# EAGLE design PRO_controller (EAGLE 8.5.0)

## Sheet 1 of 4
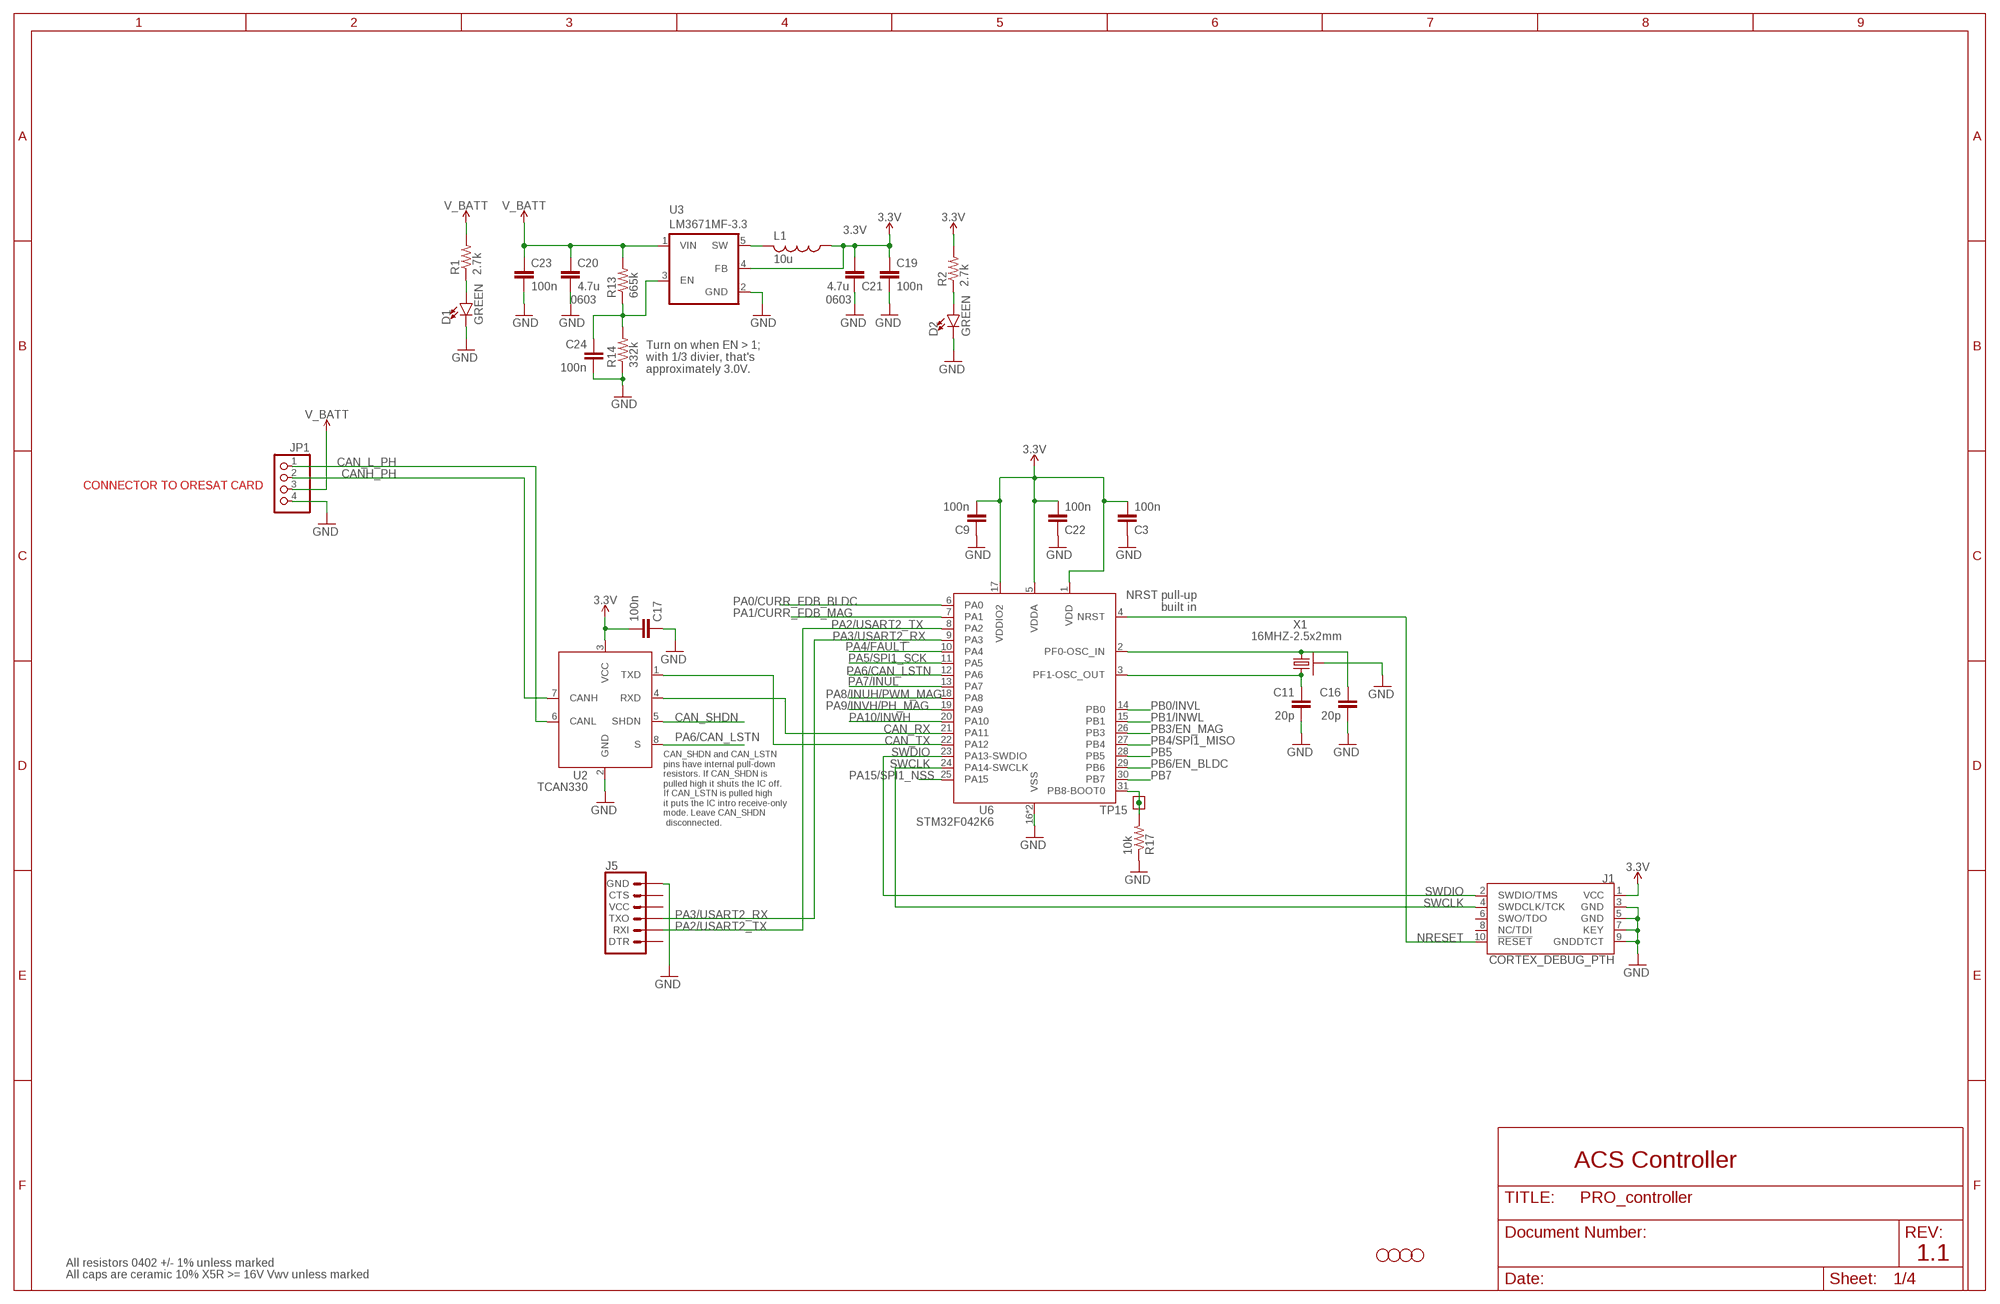
[diagram p0: schematic, sheet 1]

### Parts
C3  100n  C-EU0402-B-NOSILK  [.0402-B-NOSILK]
C9  100n  C-EU0402-B-NOSILK  [.0402-B-NOSILK]
C11  20p  C-EU0402-B-NOSILK  [.0402-B-NOSILK]
C16  20p  C-EU0402-B-NOSILK  [.0402-B-NOSILK]
C17  100n  C-EU0402-B-NOSILK  [.0402-B-NOSILK]
C19  100n  C-EU0402-B-NOSILK  [.0402-B-NOSILK]
C20  4.7u  C-EUC0603  [C0603]
C21  4.7u  C-EUC0603  [C0603]
C22  100n  C-EU0402-B-NOSILK  [.0402-B-NOSILK]
C23  100n  C-EU0402-B-NOSILK  [.0402-B-NOSILK]
C24  100n  C-EU0402-B-NOSILK  [.0402-B-NOSILK]
D1  GREEN  LED-GREEN0603  [LED-0603]
D2  GREEN  LED-GREEN0603  [LED-0603]
H1  STAND-OFFTIGHT  [STAND-OFF-TIGHT]
H2  STAND-OFFTIGHT  [STAND-OFF-TIGHT]
H3  STAND-OFFTIGHT  [STAND-OFF-TIGHT]
H4  STAND-OFFTIGHT  [STAND-OFF-TIGHT]
J1  CORTEX_DEBUG_PTH  [2X5-PTH-1.27MM]
J5  6_PIN_SERIAL_TARGETSILK  [6_PIN_SERIAL_TARGET_SIDE_W_SILK]
JP1  PINHD-1X4  [1X04]
L1  10u  L-USL2012C  [L2012C]
R1  2.7k  R-US_0402-B-NOSILK  [.0402-B-NOSILK]
R2  2.7k  R-US_0402-B-NOSILK  [.0402-B-NOSILK]
R13  665k  R-US_0402-B-NOSILK  [.0402-B-NOSILK]
R14  332k  R-US_0402-B-NOSILK  [.0402-B-NOSILK]
R17  10k  R-US_0402-B-NOSILK  [.0402-B-NOSILK]
TP15  TEST-POINT  [2MM-TEST-POINT]
U2  TCAN330  [SOT23-8_TI-DCN]
U3  LM3671MF-3.3  LM3761  [SOT23-5]
U6  STM32F042K6  [QFP32-7X7]
X1  16MHZ-2.5x2mm  CRYSTAL-WITH-GND  [CRYSTAL_2.5X2]

### Nets
3.3V: C3.2 C9.2 C17.2 C19.1 C21.1 C22.2 J1.1(VCC) L1.1 R2.2 U2.3(VCC) U3.4(FB) U6.1(VDD) U6.5(VDDA) U6.17(VDDIO2) ; also sheet 2,3,4
BOOT: R17.2 TP15.1 U6.31(PB8-BOOT0)
CAN_L_PH: JP1.1 U2.6(CANL)
CAN_RX: U2.4(RXD) U6.21(PA11)
CAN_SHDN: U2.5(SHDN)
CAN_TX: U2.1(TXD) U6.22(PA12)
CANH_PH: JP1.2 U2.7(CANH)
CRYSTALIN: C16.1 U6.2(PF0-OSC_IN) X1.1
CRYSTALOUT: C11.1 U6.3(PF1-OSC_OUT) X1.3
GND: C3.1 C9.1 C11.2 C16.2 C17.1 C19.2 C20.2 C21.2 C22.1 C23.2 C24.2 D1.C D2.C J1.3(GND) J1.5(GND) J1.7(KEY) J1.9(GNDDTCT) J5.P$6(GND) JP1.4 R14.1 R17.1 U2.2(GND) U3.2(GND) U6.16(VSS) U6.32(VSS) X1.2(SHIELD) X1.4(SHIELD) ; also sheet 2,3,4
N$270: D1.A R1.1
N$271: D2.A R2.1
NRESET: J1.10(!RESET) U6.4(NRST)
PA0/CURR_FDB_BLDC: U6.6(PA0) ; also sheet 2
PA1/CURR_FDB_MAG: U6.7(PA1) ; also sheet 3
PA2/USART2_TX: J5.P$3(RXI) U6.8(PA2)
PA3/USART2_RX: J5.P$2(TXO) U6.9(PA3)
PA4/FAULT: U6.10(PA4) ; also sheet 2
PA5/SPI1_SCK: U6.11(PA5) ; also sheet 4
PA6/CAN_LSTN: U2.8(S) U6.12(PA6)
PA7/INUL: U6.13(PA7) ; also sheet 2
PA8/INUH/PWM_MAG: U6.18(PA8) ; also sheet 2,3
PA9/INVH/PH_MAG: U6.19(PA9) ; also sheet 2,3
PA10/INWH: U6.20(PA10) ; also sheet 2
PA15/SPI1_NSS: U6.25(PA15) ; also sheet 4
PB0/INVL: U6.14(PB0) ; also sheet 2
PB1/INWL: U6.15(PB1) ; also sheet 2
PB3/EN_MAG: U6.26(PB3) ; also sheet 3
PB4/SPI1_MISO: U6.27(PB4) ; also sheet 4
PB5: U6.28(PB5)
PB6/EN_BLDC: U6.29(PB6) ; also sheet 2
PB7: U6.30(PB7)
STEPD: L1.2 U3.5(SW)
SWCLK: J1.4(SWDCLK/TCK) U6.24(PA14-SWCLK)
SWDIO: J1.2(SWDIO/TMS) U6.23(PA13-SWDIO)
V_BATT: C20.1 C23.1 JP1.3 R1.2 R13.2 U3.1(VIN) ; also sheet 2,3
VDIV: C24.1 R13.1 R14.2 U3.3(EN)
Unconnected: J1.6(SWO/TDO) J1.8(NC/TDI) J5.P$1(DTR) J5.P$4(VCC) J5.P$5(CTS)

### Notes on the sheet
- 0603 | 0603
- Turn on when EN > 1; 
  with 1/3 divier, that's
  approximately 3.0V.
- CONNECTOR TO ORESAT CARD
- NRST pull-up
  built in
- CAN_SHDN and CAN_LSTN
  pins have internal pull-down
  resistors. If CAN_SHDN is 
  pulled high it shuts the IC off.
  If CAN_LSTN is pulled high
  it puts the IC intro receive-only
  mode. Leave CAN_SHDN
   disconnected.
- ACS Controller
- 1.1
- All resistors 0402 +/- 1% unless marked
- All caps are ceramic 10% X5R >= 16V Vwv unless marked

## Sheet 2 of 4
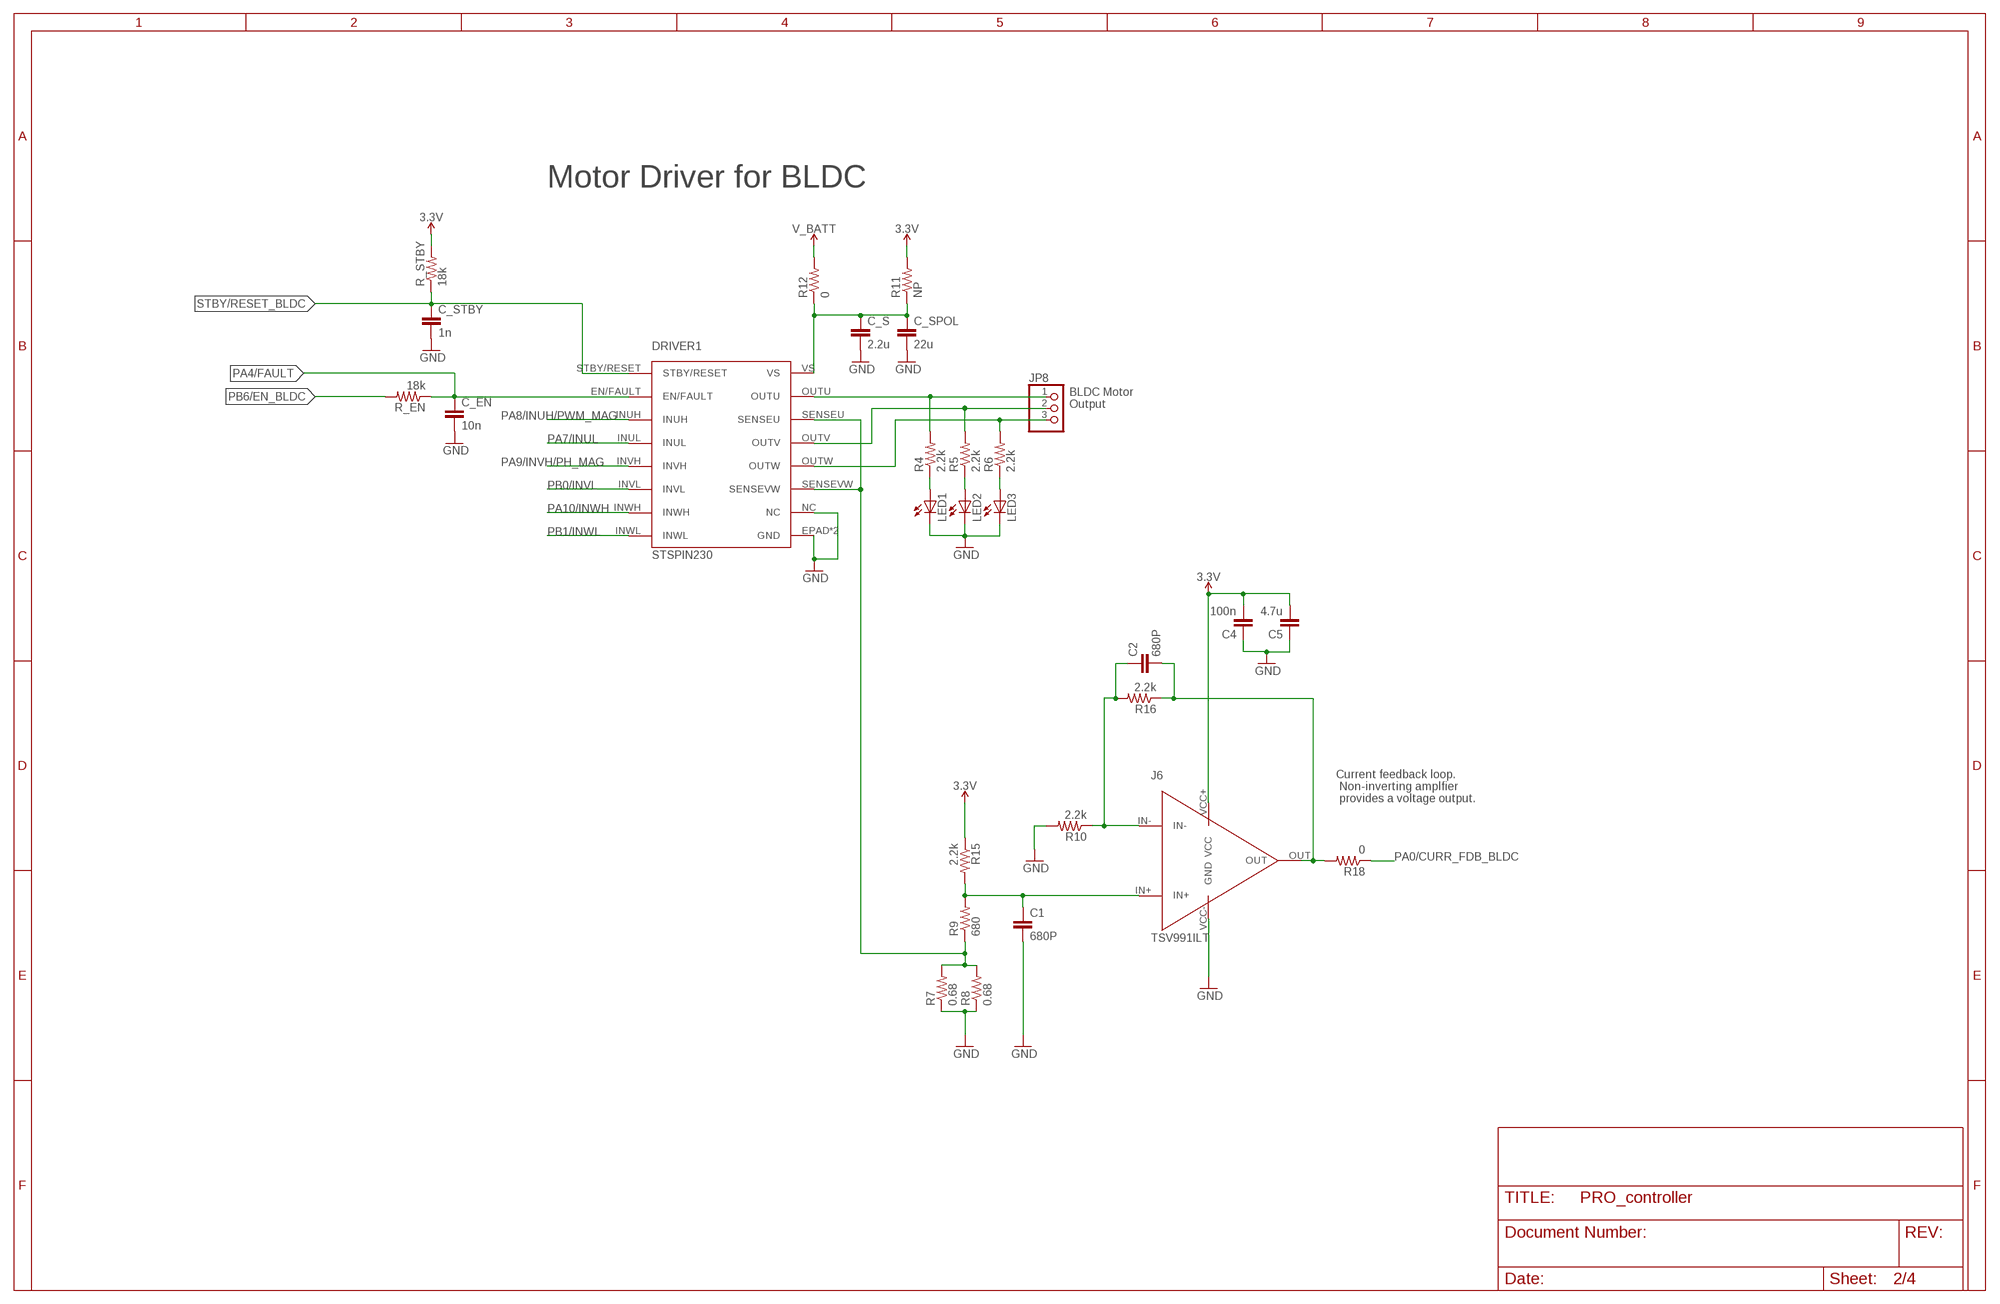
[diagram p1: schematic, sheet 2]

### Parts
C1  680P  C-EUC0402  [C0402]
C2  680P  C-EUC0402  [C0402]
C4  100n  C-EUC0402  [C0402]
C5  4.7u  C-EUC0402  [C0402]
C_EN  10n  C-EUC0402  [C0402]
C_S  2.2u  C-EUC0402  [C0402]
C_SPOL  22u  C-EUC0402  [C0402]
C_STBY  1n  C-EUC0402  [C0402]
DRIVER1  STSPIN230  [STSPIN230]
J6  TSV991ILT  [SOT23-5]
JP8  PINHD-1X3  [1X03]
LED1  LEDCHIP-LED0603  [CHIP-LED0603]
LED2  LEDCHIP-LED0603  [CHIP-LED0603]
LED3  LEDCHIP-LED0603  [CHIP-LED0603]
R4  2.2k  R-US_R0402  [R0402]
R5  2.2k  R-US_R0402  [R0402]
R6  2.2k  R-US_R0402  [R0402]
R7  0.68  R-US_R0402  [R0402]
R8  0.68  R-US_R0402  [R0402]
R9  680  R-US_R0402  [R0402]
R10  2.2k  R-US_R0402  [R0402]
R11  NP  R-US_R0402  [R0402]
R12  0  R-US_R0402  [R0402]
R15  2.2k  R-US_R0402  [R0402]
R16  2.2k  R-US_R0402  [R0402]
R18  0  R-US_R0402  [R0402]
R_EN  18k  R-US_R0402  [R0402]
R_STBY  18k  R-US_R0402  [R0402]

### Nets
3.3V: C4.2 C5.2 J6.VCC+(VCC) R11.2 R15.1 R_STBY.2 ; also sheet 1,3,4
GND: C1.2 C4.1 C5.1 C_EN.2 C_S.2 C_SPOL.2 C_STBY.2 DRIVER1.EPAD(GND) DRIVER1.GND DRIVER1.NC J6.VCC-(GND) LED1.C LED2.C LED3.C R7.1 R8.1 R10.2 ; also sheet 1,3,4
N$6: LED1.A R4.1
N$7: DRIVER1.OUTU JP8.1 R4.2
N$8: DRIVER1.OUTV JP8.2 R5.2
N$10: LED2.A R5.1
N$11: LED3.A R6.1
N$12: C_S.1 C_SPOL.1 DRIVER1.VS R11.1 R12.1
N$13: DRIVER1.SENSEU DRIVER1.SENSEVW R7.2 R8.2 R9.1
N$14: C2.1 J6.IN- R10.1 R16.2
N$16: C1.1 J6.IN+ R9.2 R15.2
N$21: DRIVER1.OUTW JP8.3 R6.2
N$29: C2.2 J6.OUT R16.1 R18.2
PA0/CURR_FDB_BLDC: R18.1 ; also sheet 1
PA4/FAULT: C_EN.1 DRIVER1.EN/FAULT R_EN.1 ; also sheet 1
PA7/INUL: DRIVER1.INUL ; also sheet 1
PA8/INUH/PWM_MAG: DRIVER1.INUH ; also sheet 1,3
PA9/INVH/PH_MAG: DRIVER1.INVH ; also sheet 1,3
PA10/INWH: DRIVER1.INWH ; also sheet 1
PB0/INVL: DRIVER1.INVL ; also sheet 1
PB1/INWL: DRIVER1.INWL ; also sheet 1
PB6/EN_BLDC: R_EN.2 ; also sheet 1
STBY/RESET_BLDC: C_STBY.1 DRIVER1.STBY/RESET R_STBY.1
V_BATT: R12.2 ; also sheet 1,3

### Notes on the sheet
- Motor Driver for BLDC
- BLDC Motor
  Output
- Current feedback loop.
   Non-inverting amplfier
   provides a voltage output.

## Sheet 3 of 4
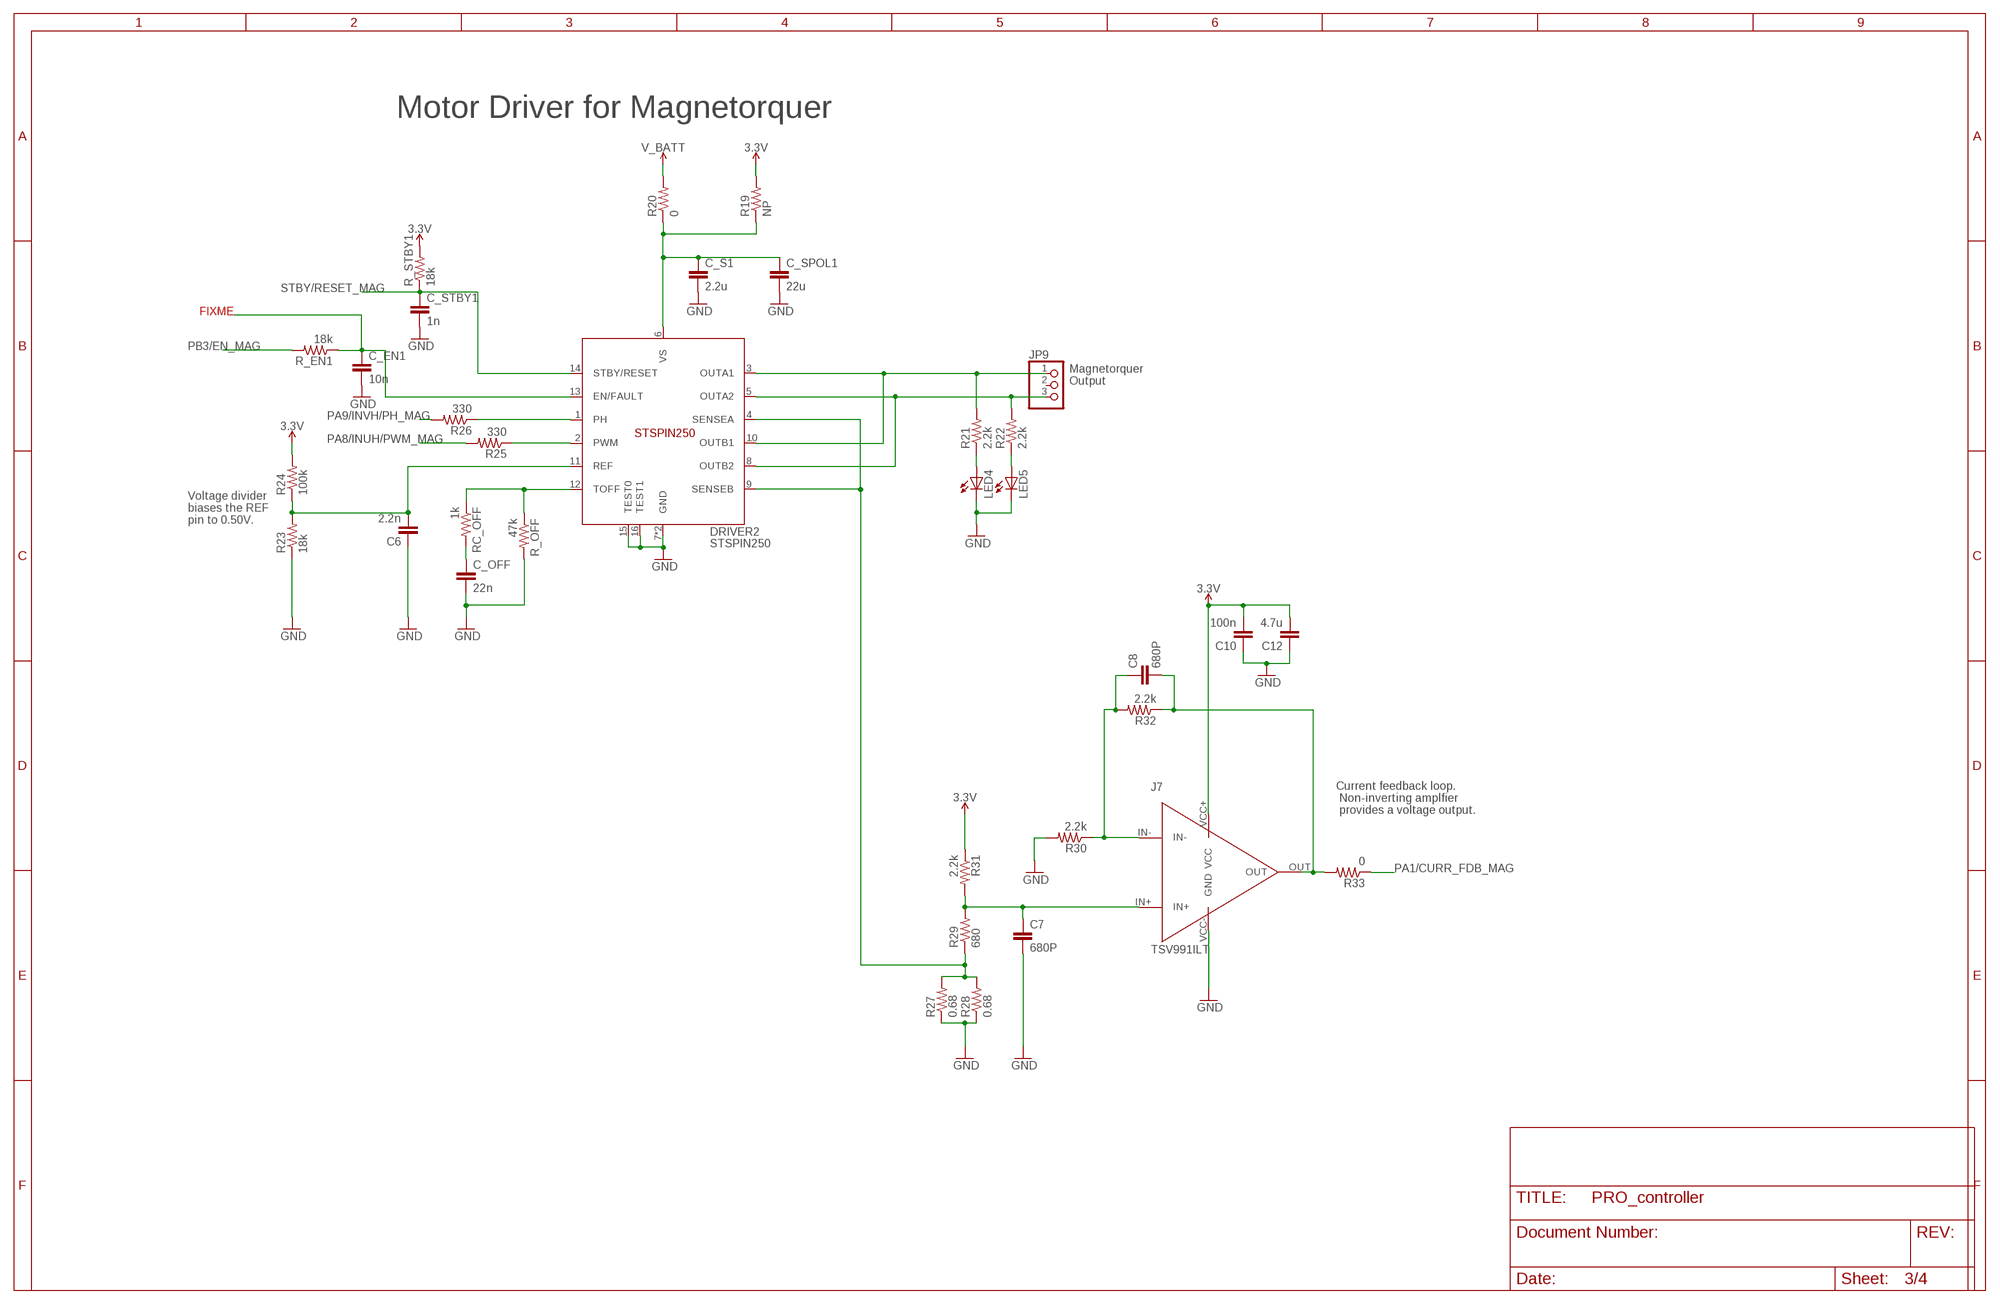
[diagram p2: schematic, sheet 3]

### Parts
C6  2.2n  C-EUC0402  [C0402]
C7  680P  C-EUC0402  [C0402]
C8  680P  C-EUC0402  [C0402]
C10  100n  C-EUC0402  [C0402]
C12  4.7u  C-EUC0402  [C0402]
C_EN1  10n  C-EUC0402  [C0402]
C_OFF  22n  C-EUC0402  [C0402]
C_S1  2.2u  C-EUC0402  [C0402]
C_SPOL1  22u  C-EUC0402  [C0402]
C_STBY1  1n  C-EUC0402  [C0402]
DRIVER2  STSPIN250  [VFQFPN]
J7  TSV991ILT  [SOT23-5]
JP9  PINHD-1X3  [1X03]
LED4  LEDCHIP-LED0603  [CHIP-LED0603]
LED5  LEDCHIP-LED0603  [CHIP-LED0603]
R19  NP  R-US_R0402  [R0402]
R20  0  R-US_R0402  [R0402]
R21  2.2k  R-US_R0402  [R0402]
R22  2.2k  R-US_R0402  [R0402]
R23  18k  R-US_R0402  [R0402]
R24  100k  R-US_R0402  [R0402]
R25  330  R-US_R0402  [R0402]
R26  330  R-US_R0402  [R0402]
R27  0.68  R-US_R0402  [R0402]
R28  0.68  R-US_R0402  [R0402]
R29  680  R-US_R0402  [R0402]
R30  2.2k  R-US_R0402  [R0402]
R31  2.2k  R-US_R0402  [R0402]
R32  2.2k  R-US_R0402  [R0402]
R33  0  R-US_R0402  [R0402]
R_EN1  18k  R-US_R0402  [R0402]
R_OFF  47k  R-US_R0402  [R0402]
R_STBY1  18k  R-US_R0402  [R0402]
RC_OFF  1k  R-US_R0402  [R0402]

### Nets
3.3V: C10.2 C12.2 J7.VCC+(VCC) R19.2 R24.2 R31.1 R_STBY1.2 ; also sheet 1,2,4
FAULT_MAG: C_EN1.1 DRIVER2.13(EN/FAULT) R_EN1.1
GND: C6.1 C7.2 C10.1 C12.1 C_EN1.2 C_OFF.2 C_S1.2 C_SPOL1.2 C_STBY1.2 DRIVER2.7(GND) DRIVER2.15(TEST0) DRIVER2.16(TEST1) DRIVER2.EPAD(GND) J7.VCC-(GND) LED4.C LED5.C R23.1 R27.1 R28.1 R30.2 R_OFF.2 ; also sheet 1,2,4
N$3: DRIVER2.2(PWM) R25.1
N$4: DRIVER2.4(SENSEA) DRIVER2.9(SENSEB) R27.2 R28.2 R29.1
N$5: DRIVER2.1(PH) R26.1
N$15: C7.1 J7.IN+ R29.2 R31.2
N$17: C8.1 J7.IN- R30.1 R32.2
N$18: C_OFF.1 RC_OFF.2
N$19: DRIVER2.12(TOFF) R_OFF.1 RC_OFF.1
N$20: C_S1.1 C_SPOL1.1 DRIVER2.6(VS) R19.1 R20.1
N$22: LED4.A R21.1
N$23: LED5.A R22.1
N$24: DRIVER2.3(OUTA1) DRIVER2.10(OUTB1) JP9.1 R21.2
N$25: C6.2 DRIVER2.11(REF) R23.2 R24.1
N$26: DRIVER2.5(OUTA2) DRIVER2.8(OUTB2) JP9.3 R22.2
N$27: C8.2 J7.OUT R32.1 R33.2
PA1/CURR_FDB_MAG: R33.1 ; also sheet 1
PA8/INUH/PWM_MAG: R25.2 ; also sheet 1,2
PA9/INVH/PH_MAG: R26.2 ; also sheet 1,2
PB3/EN_MAG: R_EN1.2 ; also sheet 1
STBY/RESET_MAG: C_STBY1.1 DRIVER2.14(STBY/RESET) R_STBY1.1
V_BATT: R20.2 ; also sheet 1,2
Unconnected: JP9.2

### Notes on the sheet
- Motor Driver for Magnetorquer
- FIXME
- Magnetorquer
  Output
- Voltage divider
  biases the REF
  pin to 0.50V.
- Current feedback loop.
   Non-inverting amplfier
   provides a voltage output.

## Sheet 4 of 4
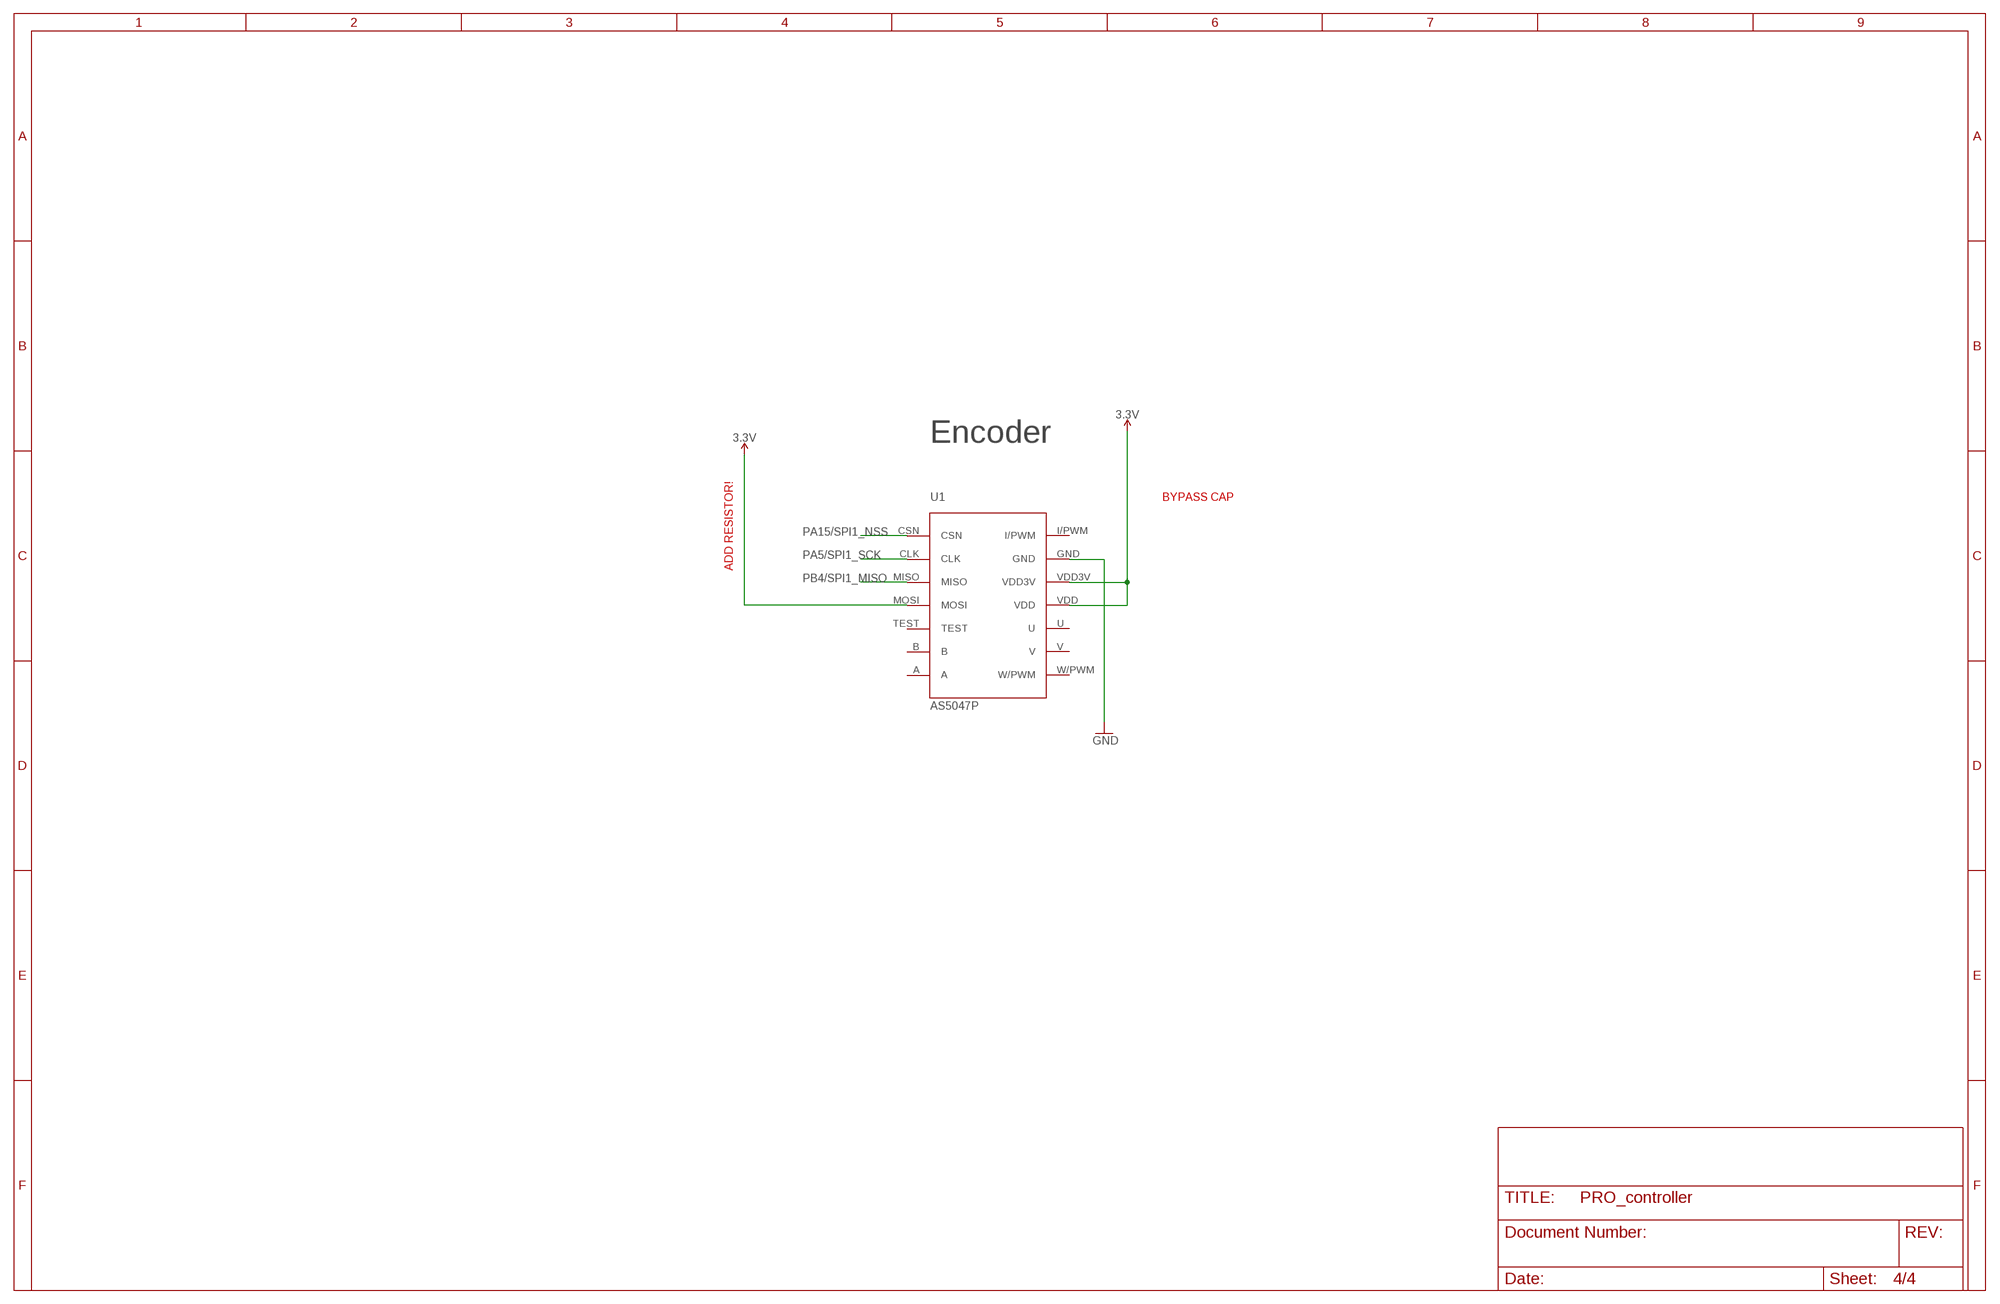
[diagram p3: schematic, sheet 4]

### Parts
U1  AS5047P  [TSSOP14]

### Nets
3.3V: U1.MOSI U1.VDD U1.VDD3V ; also sheet 1,2,3
GND: U1.GND ; also sheet 1,2,3
PA5/SPI1_SCK: U1.CLK ; also sheet 1
PA15/SPI1_NSS: U1.CSN ; also sheet 1
PB4/SPI1_MISO: U1.MISO ; also sheet 1
Unconnected: U1.A U1.B U1.I/PWM U1.TEST U1.U U1.V U1.W/PWM

### Notes on the sheet
- Encoder
- BYPASS CAP
- ADD RESISTOR!

## Library data of the parts
C1 C2 C4-C8 C10 C12 C_EN C_EN1 C_OFF C_S C_S1 C_SPOL C_SPOL1 C_STBY C_STBY1 = rcl:C-EU: CAPACITOR, European symbol; SPICEPREFIX: C
C3 C9 C17 C19 C22-C24 = rcl_custom:C-EU: CAPACITOR, European symbol; DIS: Digi-Key; DPN: 1276-1001-1-ND; MFR: Samsung; MPN: CL05B104KO5NNNC
C11 C16 = rcl_custom:C-EU: CAPACITOR, European symbol; DIS: Digi-Key; DPN: 1276-6601-1-ND; MFR: Samsung; MPN: CL05C200JB51PNC
C20 C21 = rcl:C-EU: CAPACITOR, European symbol; DIS: Digi-Key; DPN: 1276-1001-1-ND; MFR: Samsung; MPN: CL05B104KO5NNNC
D1 D2 = SparkFun-LED:LED-GREEN: Green SMD LED Used in manufacturing of various products at SparkFun Packages: 0603 - SMD 0603 package [Product Link] <http://www.futureelectronics.com/en/technologies/semiconductors/optoelectronics/leds/Pages/9894312-LTST-C190GKT.aspx?CrossPart=HSMG-C190&IM=0> LilyPad 1206 - SMD1206 LilyPad package [Product Link] <http://www.futureelectronics.com/en/Technologies/Product.aspx?ProductID=IN150NGHARVATEKCORPORATION2049943&IM=0> 1206 - SMD1206 package [Product Link] <http://www.futureelectronics.com/en/technologies/semiconductors/optoelectronics/leds/Pages/8315665-LTST-C150KGKT.aspx?IM=0> 1206 Bottom Mount -SMD 1206 Bottom Mount [Product Link] <http://www.digikey.com/product-detail/en/lite-on-inc/LTST-C230KGKT/160-1456-1-ND/386854> SparkFun Products: Pro Mini 328 -5V <https://www.sparkfun.com/products/821> RedBoard <https://www.sparkfun.com/products/12757> MP3 Trigger <https://www.sparkfun.com/products/13720> Makey Makey <https://www.sparkfun.com/products/11076>; PROD_ID: DIO-00821
DRIVER1 = STSPIN230:STSPIN230
DRIVER2 = U-ST-STSPIN250-Brushed-DC-controller:STSPIN250
H1-H4 = SparkFun-Hardware:STAND-OFF: Stand Off Drill holes for mechanically mounting via screws, standoffs, etc. Note: Use the keepout ring to avoid running the screw head into surrounding components. Variant Overviews STAND-OFF - Mechanical footprint for a #4 phillips button head screw. STAND-OFF-TIGHT - Mechanical footprint for a #4 phillips button head screw, Example SparkFun Products Screw - Phillips Head (1/4", 4-40, 10 pack) <https://www.sparkfun.com/products/10453> (PRT-10453) Screw - Phillips Head (1/2", 4-40, 10 pack) <https://www.sparkfun.com/products/10452> (PRT-10452) Screw - Phillips Head (3/4", 4-40, 10 pack) <https://www.sparkfun.com/products/10451> (PRT-10451) Screw - Phillips Head (1", 4-40, 10 pack) <https://www.sparkfun.com/products/10450> (PRT-10450)
J1 = SparkFun-Connectors:CORTEX_DEBUG: Cortex Debug Connector - 10 pin Supports JTAG debug, Serial Wire debug, and Serial Wire Viewer. PTH and SMD connector options available. General Connector Information <http://infocenter.arm.com/help/topic/com.arm.doc.faqs/attached/13634/cortex_debug_connectors.pdf> Products: PTH Connector <http://www.digikey.com/product-detail/en/cnc-tech/3220-10-0100-00/1175-1627-ND/3883661> -via Digi-Key SparkFun PSoc <https://www.sparkfun.com/products/13229> SparkFun T <https://www.sparkfun.com/products/13810>
J5 = SparkFun-Connectors:6_PIN_SERIAL_TARGET: 6-pin header connection for use with the "FTDI BASIC" pinout - TARGET SIDE. Also known as "Arduino Serial Program Header". It is used to mate with our FTDI Basic serial programmers using the Arduino IDE. Note, this device has "TARGET" in the name. It is intended to be used on a design that contains a target micro-controller that you wish to program. The "sister" device, named "CABLE" is inteneded to be used on a design that usually lives on the end of your USB cable and prvides the converter chip (FTDI232 or FTDI231x) to commnicate serial RX/TX. You can populate with some of these: Break Away Headers - Straight <https://www.sparkfun.com/products/116> (PRT-00116) For reference (or to suit your programming needs) check out these designs: SparkFun FTDI Basic Breakout - 5V <https://www.sparkfun.com/products/9716> (DEV-09716) SparkFun FTDI Basic Breakout - 3.3V <https://www.sparkfun.com/products/9873> (DEV-09873) SparkFun FTDI SmartBasic <https://www.sparkfun.com/products/12935> (DEV-12935) SparkFun Beefy 3 - FTDI Basic Breakout <https://www.sparkfun.com/products/13746> (DEV-13746)
J6 J7 = TSV991ILT:TSV991ILT
JP1 = pinhead:PINHD-1X4: PIN HEADER
JP8 JP9 = adafruit:PINHD-1X3: PIN HEADER
L1 = rcl:L-US: INDUCTOR, American symbol; DIS: Digi-Key; DPN: 587-2452-1-ND; MFR: Taiyo Yuden; MPN: CB2012T100KR
LED1-LED5 = adafruit:LED: LED OSRAM: - CHIPLED LG R971, LG N971, LY N971, LG Q971, LY Q971, LO R971, LY R971 LH N974, LH R974 LS Q976, LO Q976, LY Q976 LO Q996 - Hyper CHIPLED LW Q18S LB Q993, LB Q99A, LB R99A - SideLED LS A670, LO A670, LY A670, LG A670, LP A670 LB A673, LV A673, LT A673, LW A673 LH A674 LY A675 LS A676, LA A676, LO A676, LY A676, LW A676 LS A679, LY A679, LG A679 - Hyper Micro SIDELED® LS Y876, LA Y876, LO Y876, LY Y876 LT Y87S - SmartLED LW L88C, LW L88S LB L89C, LB L89S, LG L890 LS L89K, LO L89K, LY L89K LS L896, LA L896, LO L896, LY L896 - TOPLED LS T670, LO T670, LY T670, LG T670, LP T670 LSG T670, LSP T670, LSY T670, LOP T670, LYG T670 LG T671, LOG T671, LSG T671 LB T673, LV T673, LT T673, LW T673 LH T674 LS T676, LA T676, LO T676, LY T676, LB T676, LH T676, LSB T676, LW T676 LB T67C, LV T67C, LT T67C, LS T67K, LO T67K, LY T67K, LW E67C LS E67B, LA E67B, LO E67B, LY E67B, LB E67C, LV E67C, LT E67C LW T67C LS T679, LY T679, LG T679 LS T770, LO T770, LY T770, LG T770, LP T770 LB T773, LV T773, LT T773, LW T773 LH T774 LS E675, LA E675, LY E675, LS T675 LS T776, LA T776, LO T776, LY T776, LB T776 LHGB T686 LT T68C, LB T68C - Hyper Mini TOPLED® LB M676 - Mini TOPLED Santana® LG M470 LS M47K, LO M47K, LY M47K Source: http://www.osram.convergy.de/
R1 R2 R13 R17 = rcl_custom:R-US_: RESISTOR, American symbol; DIS: Digi-Key; DPN: 1276-4275-1-ND; MFR: Samsung; MPN: RC1005F6653CS
R4-R12 R15 R16 R18-R33 R_EN R_EN1 R_OFF R_STBY R_STBY1 RC_OFF = rcl:R-US_: RESISTOR, American symbol; SPICEPREFIX: R
R14 = rcl_custom:R-US_: RESISTOR, American symbol; DIS: Digi-Key; DPN: 1276-4245-1-ND; MFR: Samsung; MPN: RC1005F3323CS
TP15 = Tova:TEST-POINT
U1 = AS5047P:AS5047P
U2 = TCAN330:TCAN330; DIS: Digi-Key; DPN: 296-44211-1-ND; MFR: Texas Instruments; MPN: TCAN330GDCNT
U3 = LM3761:LM3761: http://www.digikey.com/product-detail/en/texas-instruments/LM3671MF-3.3-NOPB/LM3671MF-3.3-NOPBCT-ND/1590190; DIS: Digi-Key; DPN: LM3671MF-3.3/NOPBCT-ND; MFR: TI; MPN: LM3671MF-3.3/NOPB
U6 = STM32F042K:STM32F042K6; DIS: Digi-Key; DPN: STM32F042K6T7-ND; MFR: STMicroelectronics; MPN: STM32F042K6T7
X1 = low-gain-radio:CRYSTAL-WITH-GND; DIS: Digi-Key; DPN: XC2181CT-ND; MFR: ECS Inc.; MPN: ECS-160-10-36Q-ES-TR

## Board
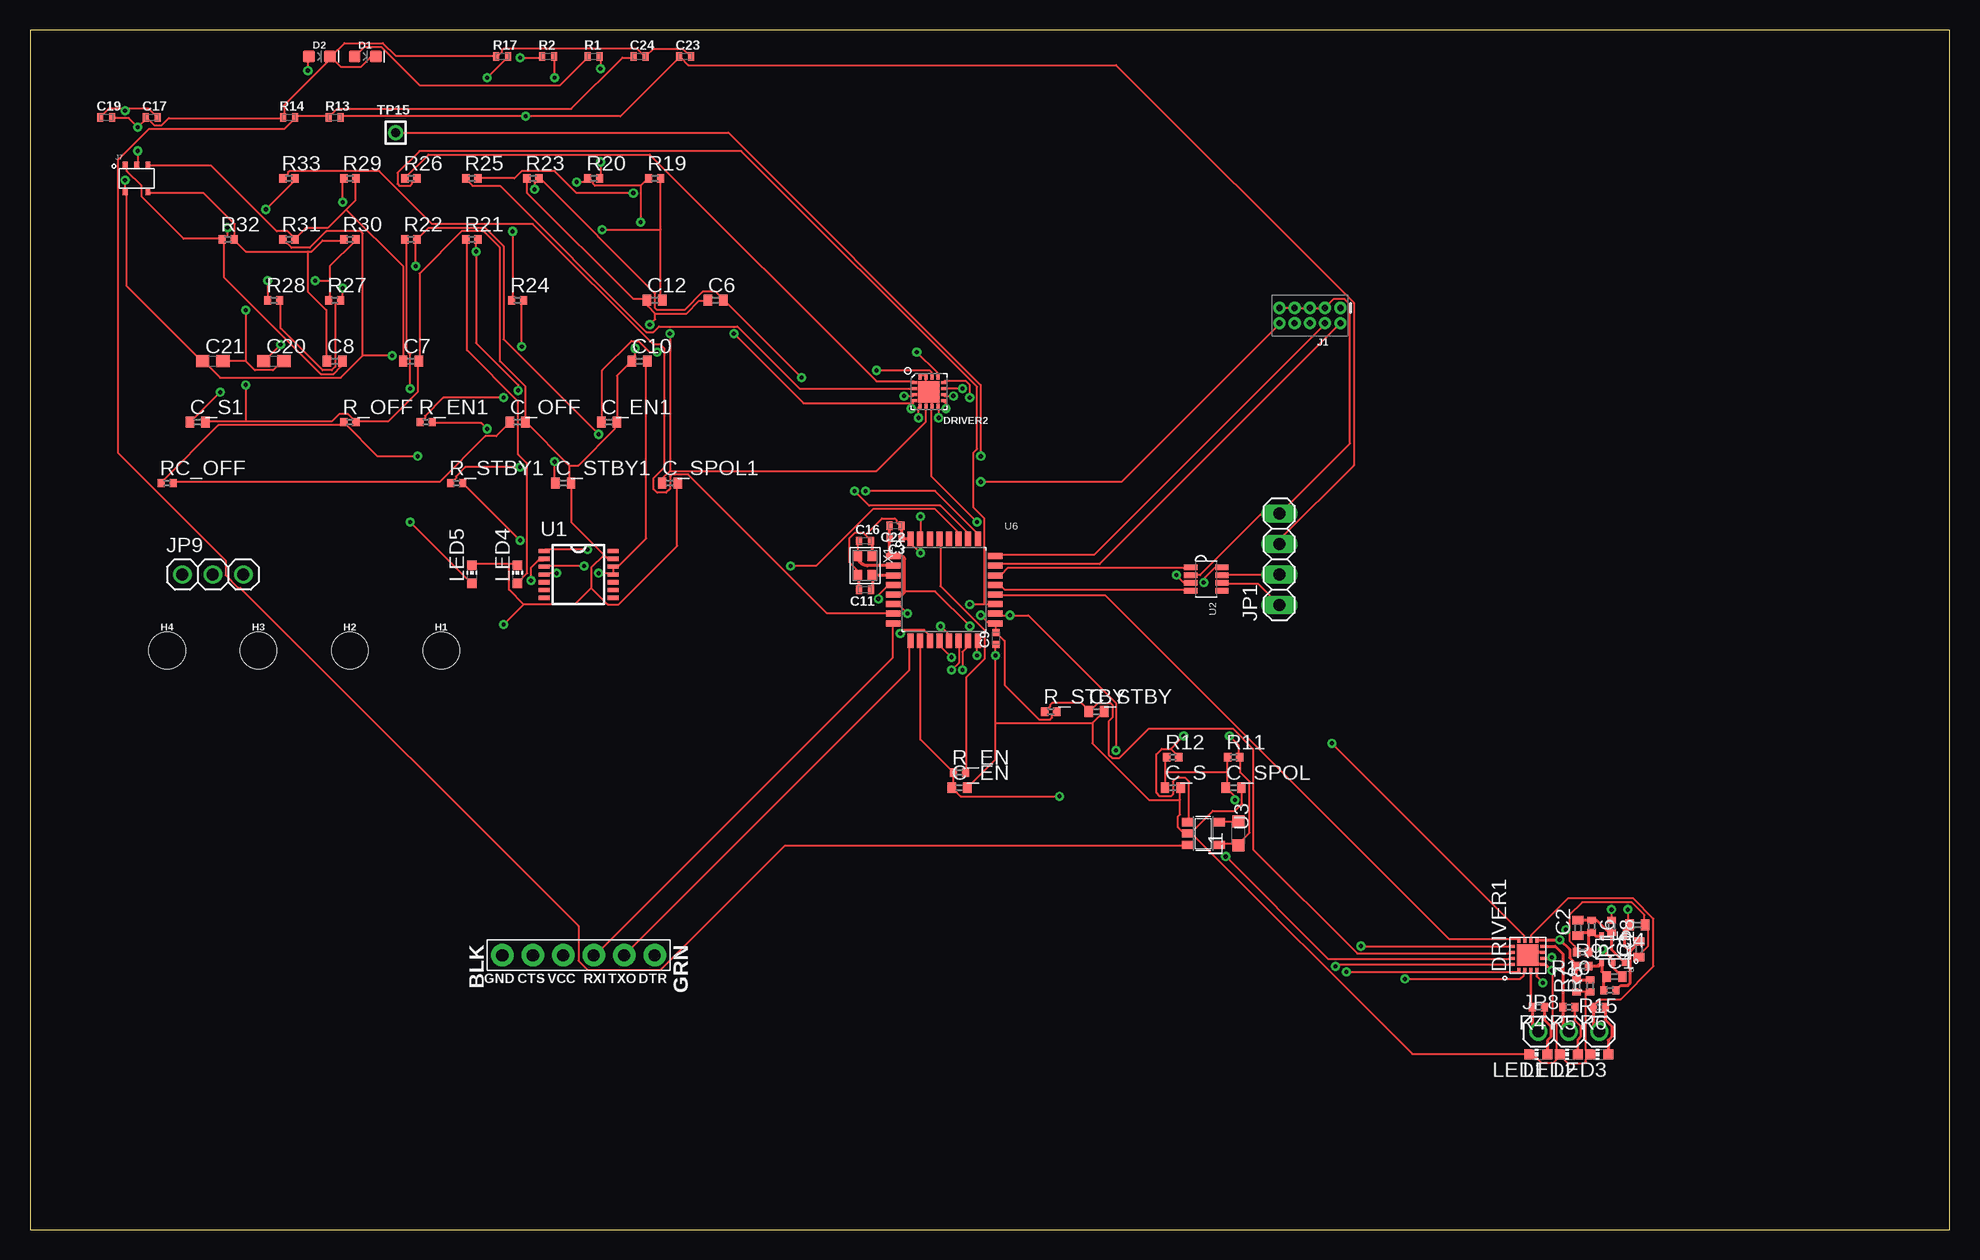
[diagram p4: board, top side]
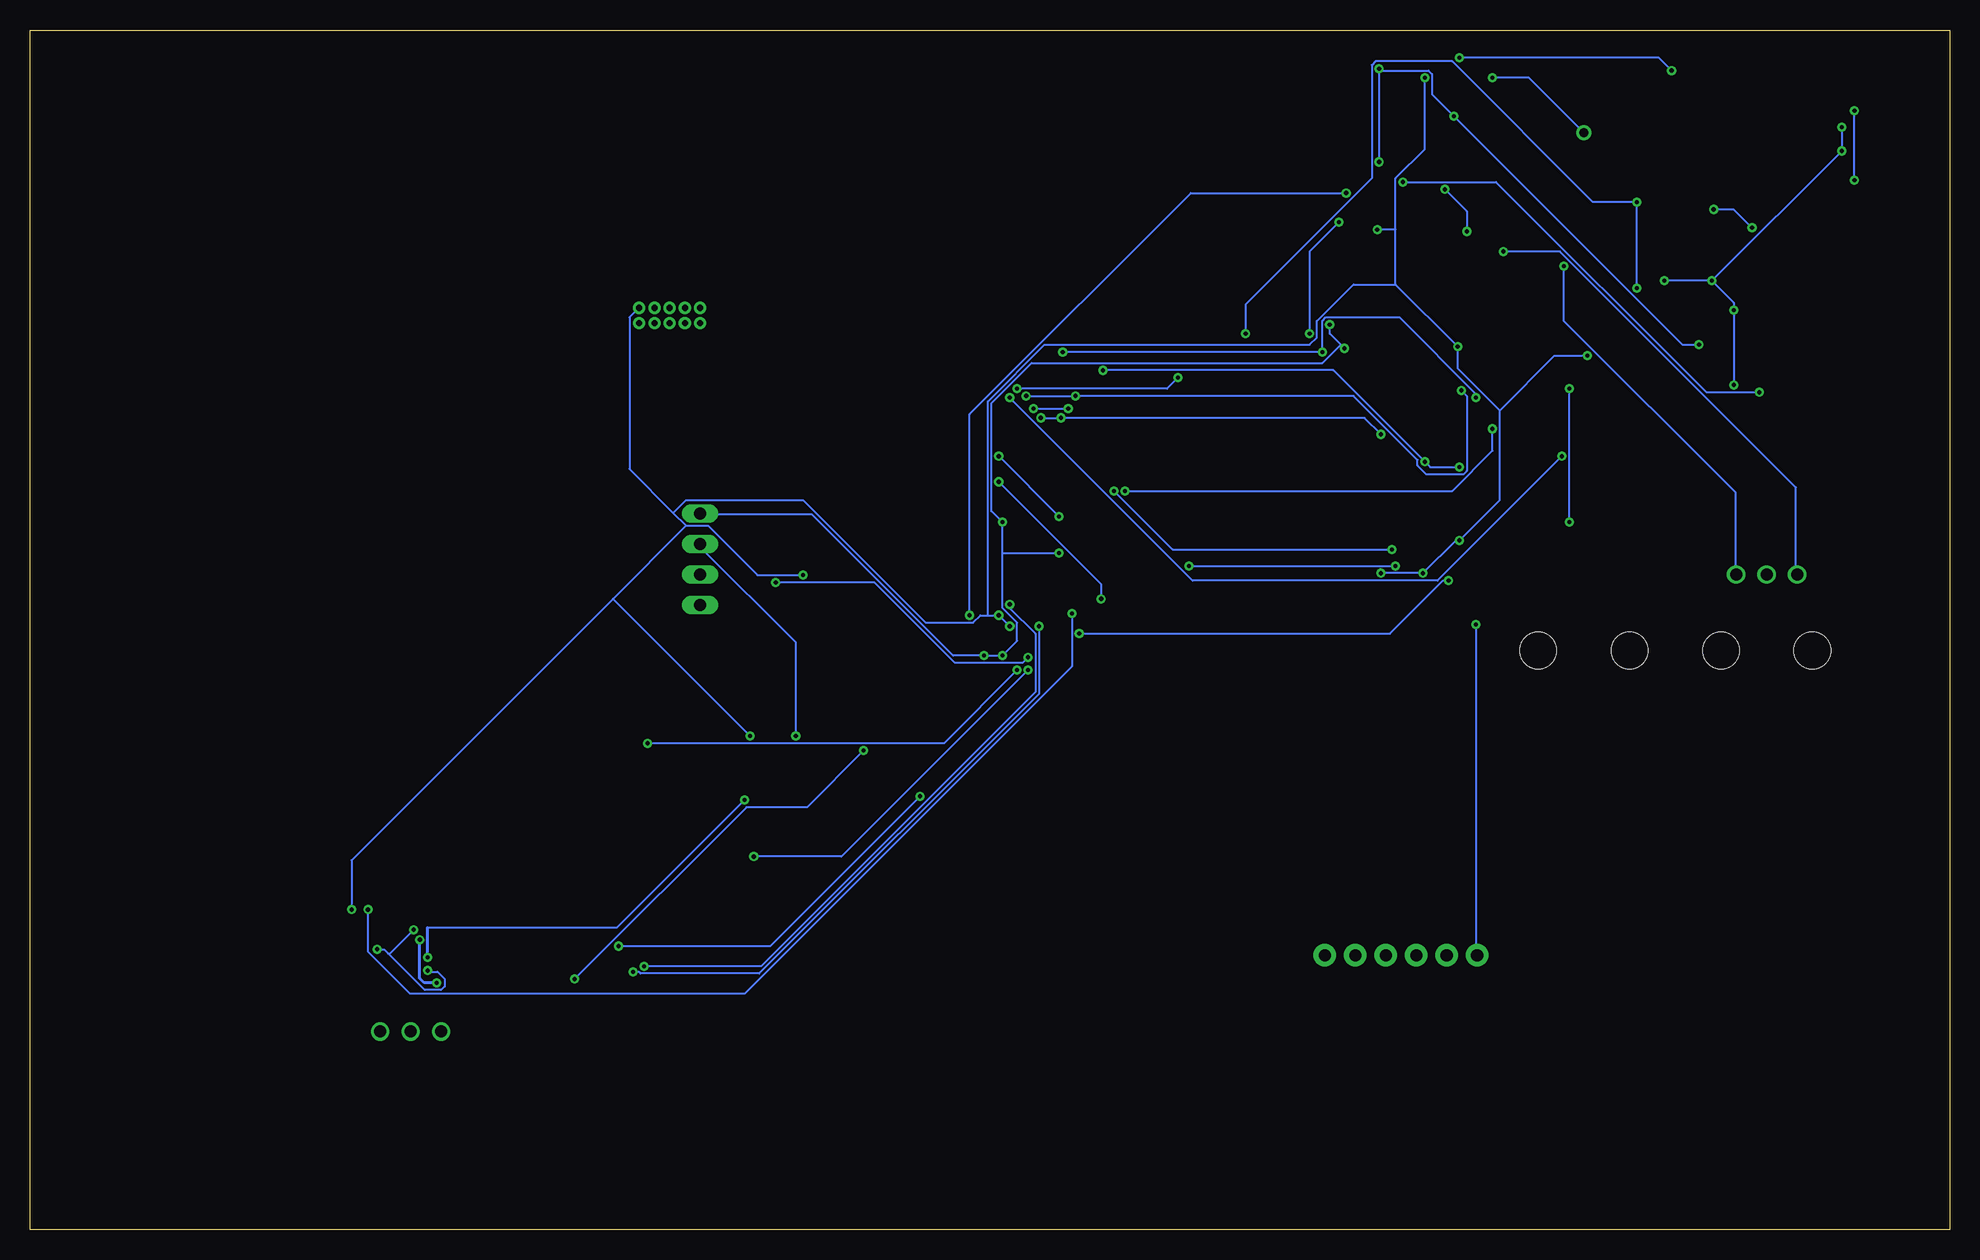
[diagram p5: board, bottom side, seen from below]

Size 160 x 100 mm. Coordinates in mm from the lower left corner, seen from the top.
Outline: 0,0 160,0 160,100 0,100 0,0
Copper layers (1*16): Top 0.035mm / dielectric 1.5mm / Bottom 0.035mm
Design rules "default": minimum track width 6mil, minimum drill 0.35mm, track to track 6mil, track to pad 6mil, pad to pad 6mil, via to via 6mil, smd to smd 6mil, copper to edge 40mil, drill to drill 6mil, minimum pad ring 10mil, minimum via ring 8mil, stop-mask expansion 4mil, vias tented up to drill 0mil, thermal gap 10mil

### Footprints (pad centres in the part's own frame; a part is rotated, then mirrored left to right if it is on the bottom)
C0402 = smd 0.7 x 0.9: 1 -0.65,0; 2 0.65,0
.0402-B-NOSILK = smd 0.6 x 0.7: 1 -0.5,0; 2 0.5,0
C0603 = smd 1.1 x 1: 1 -0.85,0; 2 0.85,0
LED-0603 = smd 1 x 1: A -0.877,0; C 0.877,0
STSPIN230 = smd 0.25 x 0.5: EN/FAULT 0.75,1.3; GND 0.25,-1.3; INVH -0.75,1.3; INVL -0.25,1.3; NC -0.75,-1.3; OUTV 0.75,-1.3; STBY/RESET 0.25,1.3; VS -0.25,-1.3 | smd 1.8 x 1.8: EPAD 0,0 | smd 0.5 x 0.25: INUH -1.3,0.25; INUL -1.3,0.75; INWH 1.3,0.75; INWL 1.3,0.25; OUTU -1.3,-0.25; OUTW 1.3,-0.25; SENSEU -1.3,-0.75; SENSEVW 1.3,-0.75
VFQFPN = smd 0.5 x 0.25: 1 -1.25,0.75; 2 -1.25,0.25; 3 -1.25,-0.25; 4 -1.25,-0.75; 9 1.25,-0.75; 10 1.25,-0.25; 11 1.25,0.25; 12 1.25,0.75 | smd 0.25 x 0.5: 5 -0.75,-1.25; 6 -0.25,-1.25; 7 0.25,-1.25; 8 0.75,-1.25; 13 0.75,1.25; 14 0.25,1.25; 15 -0.25,1.25; 16 -0.75,1.25 | smd 1.8 x 1.8: EPAD 0,0
STAND-OFF-TIGHT = hole 3.048: 0,0
2X5-PTH-1.27MM = drill 0.508 pad 1: 1 -2.54,-0.635; 2 -2.54,0.635; 3 -1.27,-0.635; 4 -1.27,0.635; 5 0,-0.635; 6 0,0.635; 7 1.27,-0.635; 8 1.27,0.635; 9 2.54,-0.635; 10 2.54,0.635
6_PIN_SERIAL_TARGET_SIDE_W_SILK = drill 1.016 pad 1.88: P$1 -6.35,0; P$2 -3.81,0; P$3 -1.27,0; P$4 1.27,0; P$5 3.81,0; P$6 6.35,0
SOT23-5 = smd 0.4 x 0.6: IN+ 0.95,1.1; IN- 0.95,-1.1; OUT -0.95,1.1; VCC+ -0.95,-1.1; VCC- 0,1.1
1X04 = drill 1.016 long: 1 -3.81,0; 2 -1.27,0; 3 1.27,0; 4 3.81,0
1X03 = drill 1.016: 1 -2.54,0; 2 0,0; 3 2.54,0
L2012C = smd 1 x 1: 1 -1,0; 2 1,0
CHIP-LED0603 = smd 0.8 x 0.8: A 0,-0.75; C 0,0.75
R0402 = smd 0.6 x 0.7: 1 -0.5,0; 2 0.5,0
2MM-TEST-POINT = drill 0.737: 1 0,0
TSSOP14 = smd 0.9 x 0.35: A -2.875,-1.95; B -2.875,-1.3; CLK -2.875,1.3; CSN -2.875,1.95; GND 2.875,1.3; I/PWM 2.875,1.95; MISO -2.875,0.65; MOSI -2.875,0; TEST -2.875,-0.65; U 2.875,-0.65; V 2.875,-1.3; VDD 2.875,0; VDD3V 2.875,0.65; W/PWM 2.875,-1.95
SOT23-8_TI-DCN = smd 0.45 x 1.1: 1 -0.975,-1.3; 2 -0.325,-1.3; 3 0.325,-1.3; 4 0.975,-1.3; 5 0.975,1.3; 6 0.325,1.3; 7 -0.325,1.3; 8 -0.975,1.3
SOT23-5' = smd 0.69 x 0.99: 1 -0.95,-1.29; 2 0,-1.29; 3 0.95,-1.29; 4 0.95,1.3; 5 -0.95,1.3
QFP32-7X7 = smd 1.2 x 0.5: 1 -4.25,2.8; 2 -4.25,2; 3 -4.25,1.2; 4 -4.25,0.4; 5 -4.25,-0.4; 6 -4.25,-1.2; 7 -4.25,-2; 8 -4.25,-2.8; 17 4.25,-2.8; 18 4.25,-2; 19 4.25,-1.2; 20 4.25,-0.4; 21 4.25,0.4; 22 4.25,1.2; 23 4.25,2; 24 4.25,2.8 | smd 0.5 x 1.2: 9 -2.8,-4.25; 10 -2,-4.25; 11 -1.2,-4.25; 12 -0.4,-4.25; 13 0.4,-4.25; 14 1.2,-4.25; 15 2,-4.25; 16 2.8,-4.25; 25 2.8,4.25; 26 2,4.25; 27 1.2,4.25; 28 0.4,4.25; 29 -0.4,4.25; 30 -1.2,4.25; 31 -2,4.25; 32 -2.8,4.25
CRYSTAL_2.5X2 = smd 0.9 x 0.8: 1 -0.825,-0.625; 2 0.825,-0.625; 3 0.825,0.625; 4 -0.825,0.625

### Placement (x,y rotation side)
C1  132.08,21.08 0 top
C2  129.03,25.15 90 top
C3  72.14,57.66 180 top
C4  133.99,25.4 180 top
C5  134.11,23.37 90 top
C6  57.15,77.47 0 top
C7  31.75,72.39 0 top
C8  25.4,72.39 0 top
C9  80.52,49.28 90 top
C10  50.8,72.39 0 top
C11  69.6,53.34 180 top
C12  52.07,77.47 0 top
C16  69.6,57.4 0 top
C17  10.16,92.71 0 top
C19  6.35,92.71 0 top
C20  20.32,72.39 0 top
C21  15.24,72.39 0 top
C22  72.14,58.67 180 top
C23  54.61,97.79 0 top
C24  50.8,97.79 0 top
C_EN  77.47,36.83 0 top
C_EN1  48.26,67.31 0 top
C_OFF  40.64,67.31 0 top
C_S  95.25,36.83 0 top
C_S1  13.97,67.31 0 top
C_SPOL  100.33,36.83 0 top
C_SPOL1  53.34,62.23 0 top
C_STBY  88.9,43.18 0 top
C_STBY1  44.45,62.23 0 top
D1  27.94,97.79 0 top
D2  24.13,97.79 0 top
DRIVER1  124.84,22.86 90 top
DRIVER2  74.93,69.85 0 top
H1  34.29,48.26 0 top
H2  26.67,48.26 0 top
H3  19.05,48.26 0 top
H4  11.43,48.26 0 top
J1  106.68,76.2 180 top
J5  45.72,22.86 180 top
J6  131.95,23.37 180 top
J7  8.89,87.63 0 top
JP1  104.14,55.88 90 top
JP8  128.27,16.51 0 top
JP9  15.24,54.61 0 top
L1  100.71,33.02 90 top
LED1  125.73,14.61 90 top
LED2  128.27,14.61 90 top
LED3  130.81,14.61 90 top
LED4  40.64,54.61 0 top
LED5  36.83,54.61 0 top
R1  46.99,97.79 0 top
R2  43.18,97.79 0 top
R4  125.73,18.54 180 top
R5  128.27,18.54 180 top
R6  130.81,18.54 180 top
R7  128.91,20.32 90 top
R8  130.05,20.32 90 top
R9  129.41,21.97 0 top
R10  129.41,23.11 180 top
R11  100.33,39.37 0 top
R12  95.25,39.37 0 top
R13  25.4,92.71 0 top
R14  21.59,92.71 0 top
R15  131.7,19.94 180 top
R16  130.18,25.27 270 top
R17  39.37,97.79 0 top
R18  131.83,25.27 270 top
R19  52.07,87.63 0 top
R20  46.99,87.63 0 top
R21  36.83,82.55 0 top
R22  31.75,82.55 0 top
R23  41.91,87.63 0 top
R24  40.64,77.47 0 top
R25  36.83,87.63 0 top
R26  31.75,87.63 0 top
R27  25.4,77.47 0 top
R28  20.32,77.47 0 top
R29  26.67,87.63 0 top
R30  26.67,82.55 0 top
R31  21.59,82.55 0 top
R32  16.51,82.55 0 top
R33  21.59,87.63 0 top
R_EN  77.47,38.1 0 top
R_EN1  33.02,67.31 0 top
R_OFF  26.67,67.31 0 top
R_STBY  85.09,43.18 0 top
R_STBY1  35.56,62.23 0 top
RC_OFF  11.43,62.23 0 top
TP15  30.48,91.44 0 top
U1  45.72,54.61 0 top
U2  98.04,54.23 270 top
U3  LM3671MF-3.3  [SOT23-5']  97.79,33.02 270 top
U6  76.2,53.34 0 top
X1  69.6,55.37 270 top

### Tracks (layer width: path | path; a pad name or v marks a point on that pad's centre or on a via)
3.3V  (via drill 0.35)
  Top 0.152: 7.92,93.42 9.91,93.42 10.52,92.81 C17.2 | 7.92,93.42 6.55,93.42 5.94,92.81 C19.1 | 27.74,72.85 27.74,83.06 27.58,83.21 24.69,83.21 23.32,81.84 21.79,81.84 21.18,82.45 R31.1 | 27.74,72.85 25.91,71.02 15.85,71.02 14.48,72.39 C21.1 14.33,72.39 8.08,78.64 8.08,86.41 J7.VCC+ 7.92,86.56 v7.92,87.48 | v7.92,93.27 7.92,93.42 | C10.2 51.36,72.39 51.36,57.61 49.07,55.32 48.62,55.32 U1.VDD3V 48.62,55.17 48.62,54.71 U1.VDD 48.46,54.71 v47.4,54.71 | 52.58,83.36 52.58,77.57 C12.2 | 52.58,83.36 R19.2 | v40.84,57.45 36.12,62.18 R_STBY1.2 | v43.89,54.71 42.98,54.71 U1.MOSI | v41,73.61 41,77.42 R24.2 | v43.74,96.01 43.74,97.69 R2.2 | v47.7,83.36 52.58,83.36 | v30.18,72.85 27.74,72.85 | R_STBY.2 85.5,43.13 85.19,42.82 85.19,42.67 85.04,42.52 84.12,42.52 81.23,45.41 81.23,49.07 80.62,49.68 C9.2 80.47,49.84 80.47,50.44 U6.17 80.31,50.6 79.86,50.6 v79.25,51.21 | v78.33,50.29 75.44,53.19 73,53.19 72.9,53.21 | U3.4 99.21,32.16 100.58,32.16 L1.1 100.74,32.16 101.65,33.07 101.65,37.34 100.89,38.1 100.89,39.32 R11.2 100.74,39.47 100.74,40.39 v99.97,41.15 | v95.56,54.56 96.16,53.95 96.62,53.95 U2.3 | v133.2,26.67 133.2,25.45 C4.2
  Top 0.254: R15.1 132.61,20.35 133.2,20.35 133.38,20.54 133.38,23.18 | C5.2 134.11,23.91 133.38,23.18 | 133.38,23.18 132.9,23.66 J6.VCC+ 132.9,24.97 C4.2 | U6.5 72.62,52.94 arc90 72.9,53.21 72.9,55.88 arc90 72.64,56.13 U6.1 arc-90 U6.1 71.64,56.14 C3.2 C22.2
  Bottom 0.152: v7.92,87.48 v7.92,93.27 | 37.49,68.28 41,71.78 v41,73.61 46.18,78.79 | 37.49,68.28 37.49,60.81 v40.84,57.45 41.15,57.45 v43.89,54.71 v47.4,54.71 | v43.74,96.01 43.74,90.07 46.18,87.63 46.18,83.36 | 46.18,78.79 46.18,83.36 | 46.18,83.36 v47.7,83.36 | v30.18,72.85 32.92,72.85 37.49,68.28 | v78.33,50.29 v79.25,51.21 80.16,51.21 | v95.56,54.56 99.36,54.56 103.48,58.67 105.31,58.67 | 106.38,59.74 110.03,63.4 110.03,76.05 109.27,76.81 J1.1 | 106.38,59.74 105.31,58.67 | v133.2,26.67 133.2,30.79 111.4,52.58 | 105.31,58.67 111.4,52.58 | 111.4,52.58 v99.97,41.15 | 80.16,51.21 80.77,51.21 81.38,50.6 85.34,50.6 95.56,60.81 105.31,60.81 106.38,59.74 | 46.18,78.79 49.68,78.79 52.73,75.74 52.73,74.37 53.34,73.76 75.44,73.76 80.16,69.04 80.16,51.21
BOOT  (via drill 0.35)
  Top 0.152: v38.1,96.01 39.78,97.69 R17.2 | v74.22,59.44 74.22,57.61 U6.31 | v79.25,64.47 79.25,70.41 58.22,91.44 TP15.1
  Bottom 0.152: v38.1,96.01 35.05,96.01 TP15.1 | v79.25,64.47 v74.22,59.44
CAN_L_PH
  Top 0.152: JP1.1 102.41,53.8 99.36,53.8 U2.6
CAN_RX
  Top 0.152: U2.4 96.62,53.34 81.23,53.34 80.92,53.65 80.47,53.65 U6.21
CAN_TX
  Top 0.152: U2.1 96.62,55.17 81.53,55.17 80.92,54.56 80.47,54.56 U6.22
CANH_PH
  Top 0.152: U2.7 99.36,54.56 104.09,54.56 JP1.2
CRYSTALIN
  Top 0.152: C16.1 69.04,57.3 69.04,56.24 X1.1
  Top 0.254: U6.2 69.83,55.34 arc-90 X1.1
CRYSTALOUT
  Top 0.254: U6.3 X1.3 arc-90 X1.3 70.22,53.47 arc-90 C11.1
FAULT_MAG  (via drill 0.35)
  Top 0.152: v73.91,73.15 75.59,71.48 75.59,71.17 DRIVER2.13 | v52.27,73.15 51.66,73.15 50.75,74.07 50.14,74.07 47.7,71.63 47.7,67.36 C_EN1.1 | v39.47,69.34 34.44,69.34 32.92,67.82 32.92,67.67 32.61,67.36 R_EN1.1
  Bottom 0.152: v73.91,73.15 v52.27,73.15 52.27,75.74 51.97,76.05 45.87,76.05 39.47,69.65 v39.47,69.34
GND  (via drill 0.35)
  Top 0.152: 17.98,67.36 25.15,67.36 25.76,67.97 26.52,67.97 27.13,67.36 R_OFF.2 27.28,67.36 29.87,67.36 32.31,69.8 32.31,72.39 C7.2 32.46,72.39 32.46,79.7 35.97,83.21 37.8,83.21 39.17,81.84 39.17,72.39 41.3,70.26 41.3,67.36 | 17.98,67.36 14.63,67.36 C_S1.2 | C23.2 55.02,97.84 54.41,98.45 51.97,98.45 51.36,97.84 C24.2 51.21,97.84 50.6,98.45 39.47,98.45 39.32,98.3 39.32,98.15 39.01,97.84 R17.1 38.86,97.84 30.48,97.84 29.41,98.91 26.21,98.91 25.15,97.84 D2.C 25.15,97.69 | 25.15,97.69 21.18,93.73 21.18,92.81 R14.1 21.03,92.66 11.58,92.66 10.97,92.05 10.36,92.05 9.75,92.66 | 25.15,97.69 25.91,96.93 27.58,96.93 28.35,97.69 28.8,97.69 D1.C | 24.99,79.1 24.99,80.31 27.13,82.45 R30.2 | 24.99,79.1 24.99,77.57 R27.1 | 17.98,72.39 C21.2 | 17.98,72.39 18.75,71.63 20.27,71.63 21.03,72.39 C20.2 | v8.99,89.92 8.99,88.85 J7.VCC- | 9.75,92.66 v8.99,91.9 8.23,92.66 6.86,92.66 C19.2 | v19.81,79.1 19.81,77.57 R28.1 | v17.98,76.66 17.98,72.39 | v23.77,79.1 24.99,79.1 | 9.75,92.66 C17.1 | v17.98,70.41 17.98,67.36 | R23.1 41.45,87.63 41.45,86.41 50.29,77.57 51.36,77.57 C12.1 51.51,77.42 51.51,76.96 52.12,76.35 | 52.12,76.35 54.71,76.35 55.78,77.42 56.39,77.42 C6.1 | 39.93,55.47 40.54,55.47 LED4.C | 39.93,55.47 36.88,55.47 LED5.C | 44.96,63.7 44.96,62.33 C_STBY1.2 45.11,62.18 45.11,58.98 47.85,56.24 | 41.3,67.36 44.96,63.7 | 47.85,56.24 48.16,55.93 48.46,55.93 U1.GND | 46.79,53.49 48.16,52.12 49.07,52.12 53.95,57 53.95,62.18 C_SPOL1.2 | 46.79,53.49 46.79,55.17 47.85,56.24 | 39.93,55.47 39.93,53.34 41.15,52.12 | 41.15,52.12 45.41,52.12 46.79,53.49 | 44.96,63.7 45.72,63.7 48.77,66.75 48.77,67.21 C_EN1.2 48.92,67.36 48.92,71.17 C10.1 50.29,72.39 50.44,72.54 v50.44,73.46
  Top 0.152: 41.15,52.12 v39.47,50.44 | 52.12,76.35 52.12,75.89 v51.66,75.44 | 41.3,67.36 C_OFF.2 | J1.9 104.24,76.81 105.31,76.81 J1.7 105.46,76.81 106.68,76.81 | 106.68,76.81 107.9,76.81 J1.3 108.05,76.96 108.66,77.57 109.58,77.57 110.03,77.11 110.03,65.53 104.24,59.74 JP1.4 104.09,59.59 102.56,59.59 97.54,54.56 96.77,54.56 U2.2 | 106.68,76.81 J1.5 | 128.32,24.99 128.32,26.21 129.39,27.28 133.5,27.28 134.57,26.21 134.57,25.45 C4.1 134.72,25.3 134.87,25.15 134.87,23.62 134.11,22.86 C5.1 | 128.32,24.99 128.32,24.08 128.78,23.62 128.78,23.16 R10.2 | 129.69,19.81 130,19.81 R8.1 | 129.69,19.81 128.93,19.81 R7.1 | 127.56,14.48 126.95,13.87 126.03,13.87 125.42,14.48 125.12,14.48 LED1.C 124.97,14.63 115.21,14.63 96.77,33.07 | 127.56,14.48 128.17,13.87 129.54,13.87 129.69,14.02 129.69,14.17 130,14.48 LED3.C 130,14.63 129.69,14.94 129.69,19.81 | 127.56,14.48 LED2.C 127.41,14.63 127.25,14.78 127.25,17.07 126.95,17.37 126.95,21.49 v126.85,21.59 | v128.02,24.99 128.32,24.99 | 95.86,35.81 95.86,34.59 95.71,34.44 95.71,33.53 96.16,33.07 96.47,33.07 U3.2 | 95.86,35.81 95.86,36.73 C_S.2 | 96.77,33.07 96.62,32.92 U3.2 | 96.77,33.07 98.6,34.9 100.43,34.9 101.04,35.51 101.04,36.73 C_SPOL.2 | 69.65,57.91 70.1,57.45 C16.2 | 69.65,57.91 69.49,58.06 68.73,58.06 68.28,57.61 68.28,55.63 68.89,55.02 68.89,54.56 X1.2 | 69.65,57.91 71.02,59.28 72.08,59.28 72.24,59.13 72.24,58.98 72.54,58.67 C22.1 | DRIVER2.16 74.22,71.17 74.68,71.17 DRIVER2.15 74.68,71.02 74.68,70.1 DRIVER2.EPAD 75.13,69.65 75.13,68.73 DRIVER2.7 75.13,68.58 75.13,62.79 v78.94,58.98 | 80.47,42.22 80.47,39.17 78.18,36.88 C_EN.2
  Top 0.152: 80.47,42.22 v80.47,47.85 80.47,48.77 C9.1 | 88.54,42.22 89.46,43.13 C_STBY.2 | 80.47,42.22 88.54,42.22 | v78.94,47.85 78.94,49.07 U6.16 | v74.22,56.39 73.46,57.15 73.46,57.45 U6.32 | 95.86,35.81 93.27,35.81 88.54,40.54 88.54,42.22 | 96.77,33.07 U3.2
  Top 0.203: 125.59,22.11 arc-90 DRIVER1.EPAD arc-90 125.09,23.11
  Top 0.254: C1.2 131.95,21.86 J6.VCC- 131.95,22.48 v131.06,23.37 | DRIVER1.GND 125.09,23.11 | 125.59,22.11 DRIVER1.NC 126.33,22.11 v126.85,21.59 | C11.2 69.1,54.42 arc90 X1.2 | X1.4 70.22,57.28 arc90 C16.2 | C22.1 C3.1 72.64,57.59 U6.32
  Bottom 0.152: v8.99,91.9 v8.99,89.92 v19.81,79.1 | v19.81,79.1 17.98,77.27 v17.98,76.66 v17.98,70.41 | v19.81,79.1 v23.77,79.1 | v39.47,50.44 39.47,22.86 J5.P$6 | v51.66,75.44 51.66,74.68 50.75,73.76 | v50.44,73.46 50.75,73.76 | 130.15,23.01 127.1,19.96 125.73,19.96 125.42,20.27 125.42,20.88 126.03,21.49 126.8,21.49 v126.85,21.59 | 130.15,23.01 130.45,23.32 131.06,23.32 v131.06,23.37 | v128.02,24.99 130,23.01 130.15,23.01 | 78.94,56.39 78.94,51.82 77.72,50.6 77.72,49.07 v78.94,47.85 v80.47,47.85 83.06,47.85 94.79,59.59 104.09,59.59 JP1.4 | 78.94,56.39 v78.94,58.98 79.86,59.89 79.86,68.89 76.5,72.24 52.27,72.24 50.75,73.76 | 78.94,56.39 v74.22,56.39
N$3
  Top 0.152: DRIVER2.2 73.61,70.1 64.16,70.1 58.98,75.29 52.43,75.29 51.97,74.83 51.36,74.83 39.17,87.02 36.88,87.02 36.27,87.63 R25.1
N$4  (via drill 0.35)
  Top 0.152: 73.61,68.89 73.61,68.58 v73.46,68.43 | 73.61,68.89 73.61,69.04 DRIVER2.4 | v76.35,68.43 76.35,68.89 76.2,69.04 DRIVER2.9 | R28.2 20.88,77.42 20.88,75.13 24.38,71.63 25.15,71.63 25.45,71.93 25.45,77.11 25.76,77.42 R27.2 25.91,77.57 26.06,77.72 v26.06,78.49 | v26.06,85.65 26.06,87.63 R29.1 | 73.61,68.89 64.47,68.89 v58.67,74.68
  Bottom 0.152: v76.35,68.43 v73.46,68.43 | v26.06,78.49 v26.06,85.65 29.72,85.65 41.45,97.38 47.85,97.38 48.16,97.08 48.16,87.63 58.67,77.11 v58.67,74.68
N$5
  Top 0.152: DRIVER2.1 73.61,70.71 70.56,70.71 51.66,89.61 33.22,89.61 R26.1
N$6
  Top 0.254: R4.1 126.23,17.48 126.77,16.94 126.77,16.08 126.48,15.79 LED1.A
N$7
  Top 0.203: DRIVER1.OUTU 125.09,18.68 R4.2
  Top 0.254: R4.2 125.23,17.01 JP8.1
N$8
  Top 0.254: JP8.2 127.77,17.01 R5.2 127.76,22.99 127.25,23.5 127.24,23.5 127.13,23.61 DRIVER1.OUTV
N$10
  Top 0.203: R5.1 128.77,17.45 129.29,16.93 129.29,16.09 129.02,15.82 LED2.A
N$11
  Top 0.254: R6.1 131.31,17.48 131.85,16.94 131.85,16.08 131.56,15.79 LED3.A
N$12  (via drill 0.35)
  Top 0.152: 94.64,38.1 94.64,36.88 C_S.1 | 94.64,38.1 94.64,39.32 R12.1 | 99.82,38.1 99.82,36.88 C_SPOL.1 99.82,36.73 100.43,36.12 v100.43,35.81 | 99.82,38.1 99.82,39.32 R11.1 | 99.82,38.1 94.64,38.1
  Top 0.254: DRIVER1.VS 126.75,22.61 126.85,22.71 | 126.87,22.73 126.85,22.71 | 126.85,22.71 v126.85,22.69
  Bottom 0.152: v100.43,35.81 111.1,25.15 126.8,25.15 126.85,25.12
  Bottom 0.254: v126.85,22.69 126.85,25.12 126.87,25.15
N$13  (via drill 0.35)
  Top 0.152: R7.2
  Top 0.203: DRIVER1.SENSEU 125.59,21.09 v126.11,20.57
  Top 0.254: R8.2 R7.2 R9.1 | R9.1 arc90 128.76,22.13 arc-90 R9.1 | DRIVER1.SENSEVW v127.51,24.16 128.33,23.33 128.33,22.65 128.91,22.07 R9.1
  Bottom 0.254: v126.11,20.57 127.13,20.57 127.51,20.95 v127.51,24.16
N$14
  Top 0.254: C2.1 129.31,24.77 R16.2 | R16.2 130.48,24.47 J6.IN- | R16.2 129.91,24.51 R10.1
N$15
  Top 0.152: 22.1,82.6 21.49,83.21 20.57,83.21 15.09,88.7 9.91,88.7 J7.IN+ | 26.36,85.04 24.84,83.52 23.01,83.52 22.1,82.6 | 26.36,85.04 27.13,85.8 27.13,87.63 R29.2 | 22.1,82.6 R31.2 | 26.36,85.04 31.09,80.31 C7.1
N$16
  Top 0.254: R9.2 130.71,21.97 | 130.71,21.97 J6.IN+ 131,21.51 C1.1 131.2,20.85 R15.2 | 130.71,21.97 130.79,21.97
N$17
  Top 0.152: J7.IN- 9.91,86.41 14.48,86.41 17.07,83.82 17.07,82.6 R32.2 17.07,82.45 17.98,81.53 23.16,81.53 | 23.16,81.53 23.47,81.53 24.38,82.45 26.06,82.45 R30.1 | 23.16,81.53 23.16,78.18 24.69,76.66 24.69,72.39 C8.1
N$18
  Top 0.152: RC_OFF.2 12.04,62.33 34.14,62.33 37.95,66.14 38.86,66.14 39.93,67.21 C_OFF.1
N$19  (via drill 0.35)
  Top 0.152: v78.33,69.34 78.33,70.41 78.03,70.71 76.2,70.71 DRIVER2.12 | v32.31,64.47 28.96,64.47 26.21,67.21 R_OFF.1 26.06,67.21 25.91,67.06 15.7,67.06 10.97,62.33 RC_OFF.1
  Bottom 0.152: v78.33,69.34 63.09,54.1 42.67,54.1 v32.31,64.47
N$20  (via drill 0.35)
  Top 0.152: 53.34,63.25 70.56,63.25 74.68,67.36 74.68,68.58 DRIVER2.6 | 53.34,63.25 52.73,62.64 52.73,62.33 C_SPOL1.1 | 50.9,87.02 47.09,87.02 46.94,87.17 46.94,87.33 46.63,87.63 R20.1 46.18,87.33 v45.57,87.33 | 50.9,87.02 51.51,87.63 R19.1 | v15.85,69.8 13.41,67.36 C_S1.1 | v53.34,74.68 53.34,63.25 | 50.9,87.02 v50.9,83.97
  Bottom 0.152: v15.85,69.8 20.27,69.8 37.8,87.33 v45.57,87.33 | v53.34,74.68 53.34,81.53 v50.9,83.97
N$21
  Top 0.152: DRIVER1.OUTW 125.12,24.23 125.12,24.54 128.17,27.58 133.66,27.58 135.33,25.91 135.33,21.95 132.59,19.2 130.91,19.2 130.3,18.59 R6.2
  Top 0.254: R6.2 130.31,17.01 JP8.3
N$22
  Top 0.152: R21.1 36.42,82.45 36.42,73.3 40.69,69.04 40.69,64.62 41.45,63.86 41.45,54.71 40.69,53.95 LED4.A
N$23  (via drill 0.35)
  Top 0.152: v31.7,70.1 31.7,73 31.39,73.3 31.39,82.45 R22.1 | v31.7,58.98 36.73,53.95 LED5.A
  Bottom 0.152: v31.7,58.98 v31.7,70.1
N$24  (via drill 0.35)
  Top 0.152: v72.85,69.49 73.61,69.49 DRIVER2.3 | v76.96,69.49 76.2,69.49 DRIVER2.10 | R21.2 37.19,82.45 v37.19,81.53 37.19,73.91 40.69,70.41 v40.69,69.95
  Bottom 0.152: v76.96,69.49 v72.85,69.49 49.68,69.49 44.35,64.16 44.35,63.7 43.59,62.94 40.54,62.94 40.23,63.25 40.23,69.49 v40.69,69.95 | v37.19,81.53 32.46,81.53 12.8,61.87 12.8,54.71 JP9.1
N$25  (via drill 0.35)
  Top 0.152: v40.23,83.21 40.23,77.57 R24.1 | v42.06,86.72 42.06,87.33 42.37,87.63 R23.2 42.52,87.63 52.12,78.03 52.12,76.81 52.27,76.66 54.56,76.66 56.08,78.18 57.15,78.18 57.76,77.57 C6.2 57.91,77.42 v64.31,71.02 | v77.72,70.1 76.2,70.1 DRIVER2.11
  Bottom 0.152: v40.23,83.21 40.23,84.89 v42.06,86.72 | v77.72,70.1 65.23,70.1 v64.31,71.02
N$26  (via drill 0.35)
  Top 0.152: v74.07,67.67 74.07,68.58 DRIVER2.5 | v75.74,67.67 75.74,68.58 DRIVER2.8 | v32.16,80.31 32.16,82.45 R22.2 32.31,82.6 33.22,83.52 37.95,83.52 39.47,81.99 39.47,74.22 v47.4,66.29
  Bottom 0.152: v75.74,67.67 v74.07,67.67 48.77,67.67 v47.4,66.29 | v32.16,80.31 32.16,75.74 17.83,61.42 17.83,54.71 JP9.3
N$27  (via drill 0.35)
  Top 0.152: J7.OUT 8.08,88.7 8.08,88.24 9.3,87.02 9.3,86.11 12.8,82.6 16,82.6 R32.1 | v19.66,85.04 21.95,87.33 21.95,87.63 R33.2 | v16.46,83.52 16.46,82.91 16.15,82.6 R32.1 | C8.2 25.91,72.39 25.91,71.93 25.3,71.32 24.23,71.32 16.15,79.4 16.15,82.45 R32.1
  Bottom 0.152: v19.66,85.04 17.98,85.04 v16.46,83.52
N$29
  Top 0.254: C2.2 130.15,25.8 R16.1 130.59,25.77 131.59,24.77 R18.2 131.83,23.34 J6.OUT
N$270
  Top 0.152: R1.1 46.48,97.69 44.2,95.4 32.46,95.4 29.26,98.6 27.89,98.6 27.13,97.84 D1.A
N$271  (via drill 0.35)
  Top 0.152: v40.84,97.69 42.67,97.69 R2.1 | v23.16,96.62 23.16,97.69 D2.A
  Bottom 0.152: v40.84,97.69 24.23,97.69 v23.16,96.62
NRESET  (via drill 0.35)
  Top 0.152: v70.71,52.58 70.71,52.88 71.48,53.65 71.93,53.65 U6.4 | v79.25,62.33 90.98,62.33 104.09,75.44 J1.10
  Bottom 0.152: v70.71,52.58 70.71,53.8 v79.25,62.33
PA0/CURR_FDB_BLDC  (via drill 0.35)
  Top 0.152: v131.83,26.67 R18.1 | v73.15,51.36 72.39,52.12 72.08,52.12 U6.6
  Bottom 0.152: v131.83,26.67 131.83,23.16 128.32,19.66 100.43,19.66 73.15,46.94 v73.15,51.36
PA1/CURR_FDB_MAG
  Top 0.152: R33.1 21.18,87.63 21.49,87.94 21.49,88.09 21.64,88.24 29.11,88.24 33.53,83.82 41.91,83.82 51.97,73.76 52.58,73.76 52.88,73.46 52.88,63.55 51.97,62.64 51.97,61.72 52.27,61.42 53.03,61.42 53.34,61.72 53.34,62.79 53.49,62.94 54.86,62.94 66.45,51.36 71.93,51.36 U6.7
PA2/USART2_TX
  Top 0.152: U6.8 71.93,50.44 71.93,47.7 47.09,22.86 J5.P$3
PA3/USART2_RX
  Top 0.152: J5.P$2 73.3,46.63 73.3,49.07 U6.9
PA4/FAULT  (via drill 0.35)
  Top 0.152: v110.95,23.62 123.44,23.62 DRIVER1.EN/FAULT | v85.8,36.12 77.57,36.12 76.96,36.73 C_EN.1 76.96,36.88 R_EN.1 | R_EN.1 74.22,40.84 74.22,49.07 U6.10 | R_EN.1
  Bottom 0.152: v110.95,23.62 98.3,23.62 v85.8,36.12
PA5/SPI1_SCK  (via drill 0.35)
  Top 0.152: v41.76,54.1 41.76,55.17 42.37,55.78 42.82,55.78 U1.CLK | v72.54,49.68 72.85,49.99 74.52,49.99 74.98,49.53 74.98,49.23 U6.11
  Bottom 0.152: v41.76,54.1 42.22,54.1 46.63,49.68 v72.54,49.68
PA6/CAN_LSTN  (via drill 0.35)
  Top 0.152: v97.84,53.95 97.84,54.25 98.75,55.17 99.21,55.17 U2.8 | v76.81,47.7 75.89,48.62 75.89,49.07 U6.12
  Bottom 0.152: v97.84,53.95 89.61,53.95 82.91,47.24 77.27,47.24 v76.81,47.7
PA7/INUL  (via drill 0.35)
  Top 0.152: v109.73,21.49 124.05,21.49 DRIVER1.INUL | v75.89,50.29 76.5,49.68 76.5,49.23 U6.13
  Bottom 0.152: v109.73,21.49 109.27,21.49 109.12,21.34 99.21,21.34 75.89,44.65 v75.89,50.29
PA8/INUH/PWM_MAG  (via drill 0.35)
  Top 0.152: v114.61,20.88 124.21,20.88 124.51,21.18 124.51,21.49 DRIVER1.INUH | v90.53,39.93 90.53,43.89 83.21,51.21 v81.69,51.21 80.47,51.21 U6.18 | R25.2 40.39,87.63 41,88.24 43.74,88.24 45.57,86.41 v50.29,86.41
  Bottom 0.152: v114.61,20.88 100.28,35.2 95.25,35.2 v90.53,39.93 | v50.29,86.41 63.25,86.41 81.69,67.97 v81.69,51.21
PA9/INVH/PH_MAG  (via drill 0.35)
  Top 0.152: v108.81,21.95 108.97,22.1 123.44,22.1 DRIVER1.INVH | 79.55,52.12 80.31,52.12 U6.19 | 79.55,52.12 v78.33,52.12 | 79.55,52.12 79.55,59.28 78.64,60.2 78.64,64.77 78.94,65.08 78.94,70.26 59.28,89.92 32.46,89.92 30.63,88.09 30.63,87.17 30.79,87.02 31.7,87.02 31.85,87.17 31.85,87.33 32.16,87.63 R26.2
  Bottom 0.152: v108.81,21.95 99.06,21.95 76.2,44.81 76.2,49.68 78.33,51.82 v78.33,52.12
PA10/INWH
  Top 0.152: DRIVER1.INWH 124.05,24.23 118.26,24.23 89.61,52.88 80.47,52.88 U6.20
PA15/SPI1_NSS  (via drill 0.35)
  Top 0.152: v46.48,56.69 42.98,56.69 U1.CSN | v69.65,61.57 75.44,61.57 78.94,58.06 78.94,57.61 U6.25
  Bottom 0.152: v46.48,56.69 64.77,56.69 v69.65,61.57
PB0/INVL  (via drill 0.35)
  Top 0.152: v99.67,31.09 108.2,22.55 123.44,22.55 DRIVER1.INVL | v76.81,46.63 77.42,47.24 77.42,49.07 U6.14
  Bottom 0.152: v99.67,31.09 92.35,31.09 v76.81,46.63
PB1/INWL  (via drill 0.35)
  Top 0.152: v108.51,40.54 124.51,24.54 124.51,24.23 DRIVER1.INWL | v77.72,46.63 77.72,48.16 78.18,48.62 78.18,49.07 U6.15
  Bottom 0.152: v108.51,40.54 83.82,40.54 v77.72,46.63
PB3/EN_MAG  (via drill 0.35)
  Top 0.152: v38.1,66.75 37.64,67.21 33.53,67.21 R_EN1.2 | v68.73,61.57 69.95,60.35 75.89,60.35 78.18,58.06 78.18,57.61 U6.26
  Bottom 0.152: v38.1,66.75 38.1,64.92 41.45,61.57 v68.73,61.57
PB4/SPI1_MISO  (via drill 0.35)
  Top 0.152: v46.18,55.32 42.98,55.32 U1.MISO | v63.4,55.32 65.53,55.32 70.26,60.05 75.44,60.05 77.27,58.22 77.27,57.61 U6.27
  Bottom 0.152: v63.4,55.32 v46.18,55.32
PB6/EN_BLDC
  Top 0.152: R_EN.2 78.03,38.1 78.03,46.02 79.55,47.55 79.55,49.99 75.89,53.65 75.89,57.45 U6.29
STBY/RESET_BLDC
  Top 0.152: DRIVER1.STBY/RESET 123.44,23.01 110.64,23.01 101.96,31.7 101.96,40.08 100.28,41.76 93.27,41.76 90.83,39.32 90.22,39.32 89.92,39.62 89.92,42.37 90.22,42.67 90.22,43.74 90.07,43.89 89,43.89 88.39,43.28 C_STBY.1 88.24,43.28 87.63,43.89 85.19,43.89 85.04,43.74 85.04,43.59 84.73,43.28 R_STBY.1
STBY/RESET_MAG  (via drill 0.35)
  Top 0.152: v70.56,71.63 74.98,71.63 75.13,71.48 75.13,71.17 DRIVER2.14 | v43.74,64.01 43.74,62.33 C_STBY1.1 | v40.84,63.55 36.27,63.55 35.51,62.79 35.51,62.64 35.2,62.33 R_STBY1.1
  Bottom 0.152: v70.56,71.63 51.36,71.63 v43.74,64.01 43.28,63.55 v40.84,63.55
STEPD
  Top 0.152: U3.5 99.21,33.98 100.58,33.98 L1.2
SWCLK
  Top 0.152: U6.24 80.47,56.24 88.7,56.24 107.9,75.44 J1.4
SWDIO
  Top 0.152: U6.23 80.47,55.47 89.15,55.47 109.12,75.44 J1.2
V_BATT  (via drill 0.35)
  Top 0.152: 95.1,40.08 95.71,39.47 R12.2 | 95.1,40.08 94.34,40.08 93.88,39.62 93.88,36.42 94.18,36.12 95.1,36.12 95.25,36.27 95.25,37.34 95.56,37.64 96.32,37.64 96.62,37.34 96.62,33.98 U3.1 | 95.1,40.08 v96.16,41.15 | R13.2 25.91,92.81 v41.3,92.81 49.23,92.81 54.1,97.69 C23.1 54.25,97.69 54.86,97.08 90.53,97.08 110.34,77.27 110.34,63.7 104.24,57.61 104.24,57.15 JP1.3 | v47.55,89 47.55,87.63 R20.2 | v47.55,96.77 47.55,97.69 R1.2 | v20.88,73.76 19.51,72.39 C20.1
  Bottom 0.152: v96.16,41.15 96.16,48.92 104.09,56.84 104.09,57.15 JP1.3 | 47.55,96.62 v47.55,89 | v20.88,73.76 22.25,73.76 v41.3,92.81 43.13,94.64 43.13,96.32 43.43,96.62 47.55,96.62 | 47.55,96.62 v47.55,96.77
VDIV
  Top 0.152: C24.1 50.29,97.69 49.38,97.69 45.11,93.42 25.6,93.42 24.99,92.81 R13.1 24.84,92.81 22.1,92.81 R14.2 22.1,92.66 21.18,91.75 9.91,91.75 7.32,89.15 7.32,64.77 16.31,55.78 16.31,54.56 17.37,53.49 17.53,53.49 45.72,25.3 45.72,22.4 46.48,21.64 52.58,21.64 62.94,32 96.47,32 U3.3